# Altium project FMU_F7H7.PrjPcb
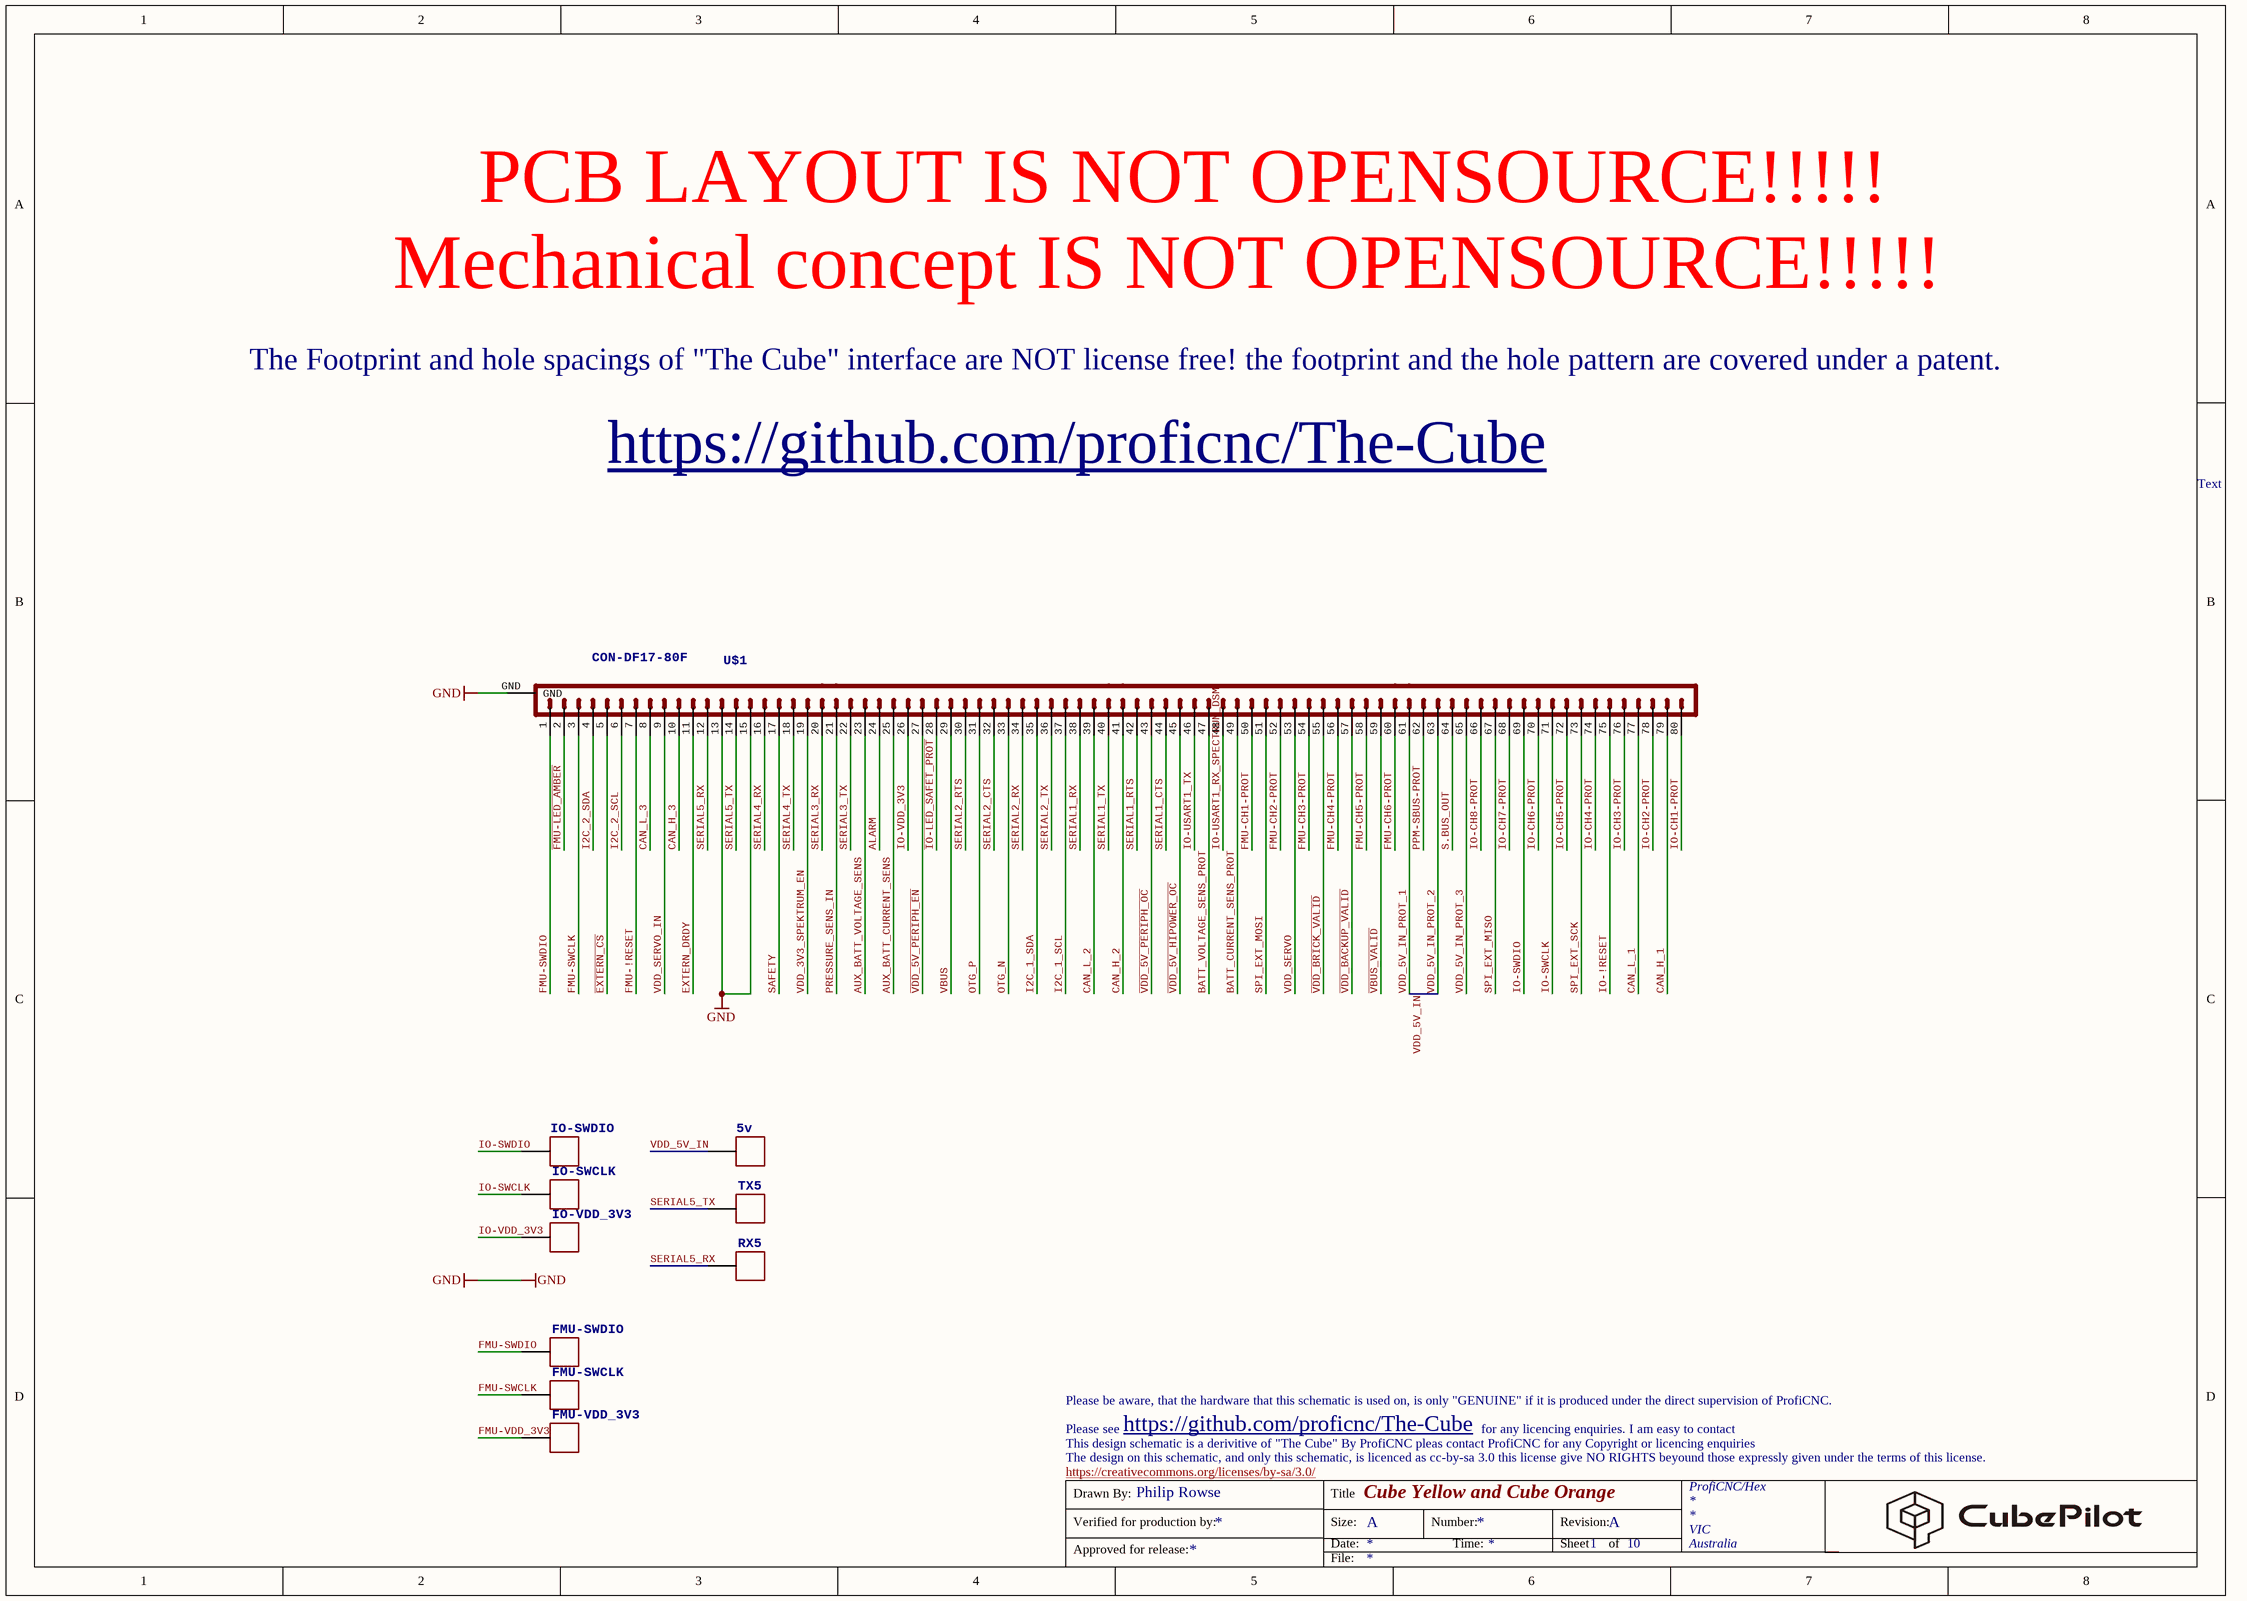
[diagram p0: 80PIN_FMU_REV_2A.SchDoc]
10 sheets, 142 parts. Net scope: global (net labels, ports and power ports of the same name join across sheets).
Board file: CubeOrange.PcbDoc
Sheets:
  80PIN_FMU_REV_2A.SchDoc
  FMU_FMU_REV_2A.SchDoc
  FMU_Power_FMU_REV_2A.SchDoc
  IO_FMU_REV_2A.SchDoc
  IO_PWR_FMU_REV_2A.SchDoc
  LEDs_FMU_REV_2A.SchDoc
  PWM_PPM_FMU_REV_2A.SchDoc
  SD_USB_FMU_REV_2A.SchDoc
  SENSORS_FMU_REV_2A.SchDoc
  SERIAL_FMU_REV_2A.SchDoc

## Sheet 80PIN_FMU_REV_2A.SchDoc: Cube Yellow and Cube Orange
size A3; Date: 18/08/2014 1:53:28 PM; Author: PR; DrawnBy: Philip Rowse; Engineer: Philip Rowse; Organization: ProfiCNC/Hex; Address3: VIC; Address4: Australia; Revision: A; SheetNumber: 1; SheetTotal: 10

### Parts
5v  PAD.04  [PAD.04X.04]  (value not drawn)
FMU-SWCLK  PAD.04  [PAD.04X.04]  (value not drawn)
FMU-SWDIO  PAD.04  [PAD.04X.04]  (value not drawn)
FMU-VDD_3V3  PAD.04  [PAD.04X.04]  (value not drawn)
IO-SWCLK  PAD.04  [PAD.04X.04]  (value not drawn)
IO-SWDIO  PAD.04  [PAD.04X.04]  (value not drawn)
IO-VDD_3V3  PAD.04  [PAD.04X.04]  (value not drawn)
RX5  PAD.04  [PAD.04X.04]  (value not drawn)
TX5  PAD.04  [PAD.04X.04]  (value not drawn)
U$1  CON-DF17-80F  [CON-DF17-80F]

### Nets
GND: U$1.13 U$1.15 U$1.GND
ALARM: U$1.24
AUX_BATT_CURRENT_SENS: U$1.25
AUX_BATT_VOLTAGE_SENS: U$1.23
BATT_CURRENT_SENS_PROT: U$1.49
BATT_VOLTAGE_SENS_PROT: U$1.47
CAN_H_1: U$1.79
CAN_H_2: U$1.41
CAN_H_3: U$1.10
CAN_L_1: U$1.77
CAN_L_2: U$1.39
CAN_L_3: U$1.8
~{EXTERN_CS}: U$1.5
EXTERN_DRDY: U$1.11
~{FMU-LED_AMBER}: U$1.2
FMU-!RESET: U$1.7
FMU-CH1-PROT: U$1.50
FMU-CH2-PROT: U$1.52
FMU-CH3-PROT: U$1.54
FMU-CH4-PROT: U$1.56
FMU-CH5-PROT: U$1.58
FMU-CH6-PROT: U$1.60
FMU-SWCLK: FMU-SWCLK.P$1 U$1.3
FMU-SWDIO: FMU-SWDIO.P$1 U$1.1
FMU-VDD_3V3: FMU-VDD_3V3.P$1
I2C_1_SCL: U$1.37
I2C_1_SDA: U$1.35
I2C_2_SCL: U$1.6
I2C_2_SDA: U$1.4
~{IO-LED_SAFET_PROT}: U$1.28
IO-!RESET: U$1.75
IO-CH1-PROT: U$1.80
IO-CH2-PROT: U$1.78
IO-CH3-PROT: U$1.76
IO-CH4-PROT: U$1.74
IO-CH5-PROT: U$1.72
IO-CH6-PROT: U$1.70
IO-CH7-PROT: U$1.68
IO-CH8-PROT: U$1.66
IO-SWCLK: IO-SWCLK.P$1 U$1.71
IO-SWDIO: IO-SWDIO.P$1 U$1.69
IO-USART1_RX_SPECTRUM_DSM: U$1.48
IO-USART1_TX: U$1.46
IO-VDD_3V3: IO-VDD_3V3.P$1 U$1.26
OTG_N: U$1.33
OTG_P: U$1.31
PPM-SBUS-PROT: U$1.62
PRESSURE_SENS_IN: U$1.21
S.BUS_OUT: U$1.64
SAFETY: U$1.17
SERIAL1_CTS: U$1.44
SERIAL1_RTS: U$1.42
SERIAL1_RX: U$1.38
SERIAL1_TX: U$1.40
SERIAL2_CTS: U$1.32
SERIAL2_RTS: U$1.30
SERIAL2_RX: U$1.34
SERIAL2_TX: U$1.36
SERIAL3_RX: U$1.20
SERIAL3_TX: U$1.22
SERIAL4_RX: U$1.16
SERIAL4_TX: U$1.18
SERIAL5_RX: RX5.P$1 U$1.12
SERIAL5_TX: TX5.P$1 U$1.14
SPI_EXT_MISO: U$1.67
SPI_EXT_MOSI: U$1.51
SPI_EXT_SCK: U$1.73
~{VBUS_VALID}: U$1.59
~{VDD_5V_HIPOWER_OC}: U$1.45
~{VDD_5V_PERIPH_EN}: U$1.27
~{VDD_5V_PERIPH_OC}: U$1.43
~{VDD_BACKUP_VALID}: U$1.57
~{VDD_BRICK_VALID}: U$1.55
VBUS: U$1.29
VDD_3V3_SPEKTRUM_EN: U$1.19
VDD_5V_IN: 5v.P$1 U$1.61 U$1.63  [also labelled VDD_5V_IN_PROT_1, VDD_5V_IN_PROT_2]
VDD_5V_IN_PROT_3: U$1.65
VDD_SERVO: U$1.53
VDD_SERVO_IN: U$1.9

### Notes on the sheet
- PCB LAYOUT IS NOT OPENSOURCE!!!!!
- Mechanical concept IS NOT OPENSOURCE!!!!!
- The Footprint and hole spacings of "The Cube" interface are NOT license free! the footprint and the hole pattern are covered under a patent.
- https://github.com/proficnc/The-Cube
- Text
- Please be aware, that the hardware that this schematic is used on, is only "GENUINE" if it is produced under the direct supervision of ProfiCNC.
- The design on this schematic, and only this schematic, is licenced as cc-by-sa 3.0 this license give NO RIGHTS beyound those expressly given under the terms of this license.
- This design schematic is a derivitive of "The Cube" By ProfiCNC pleas contact ProfiCNC for any Copyright or licencing enquiries
- https://creativecommons.org/licenses/by-sa/3.0/
- Please see
- for any licencing enquiries. I am easy to contact
- Drawn By:
- Verified for production by:
- Approved for release:
- Title
- Size:
- Date:
- A
- Number:
- Time:
- Revision:
- Sheet
- of
- File:

### Library data of the parts
U$1 = CON-DF17-80F: CONN RECEPT 80POS .5MM SMD W/FIT

## Sheet FMU_FMU_REV_2A.SchDoc: Cube Yellow and Cube Orange
size A3; Date: 18/08/2014 1:53:18 PM; Author: PR; DrawnBy: Philip Rowse; Engineer: Philip Rowse; Organization: ProfiCNC/Hex; Address3: VIC; Address4: Australia; Revision: A; SheetNumber: 2; SheetTotal: 10
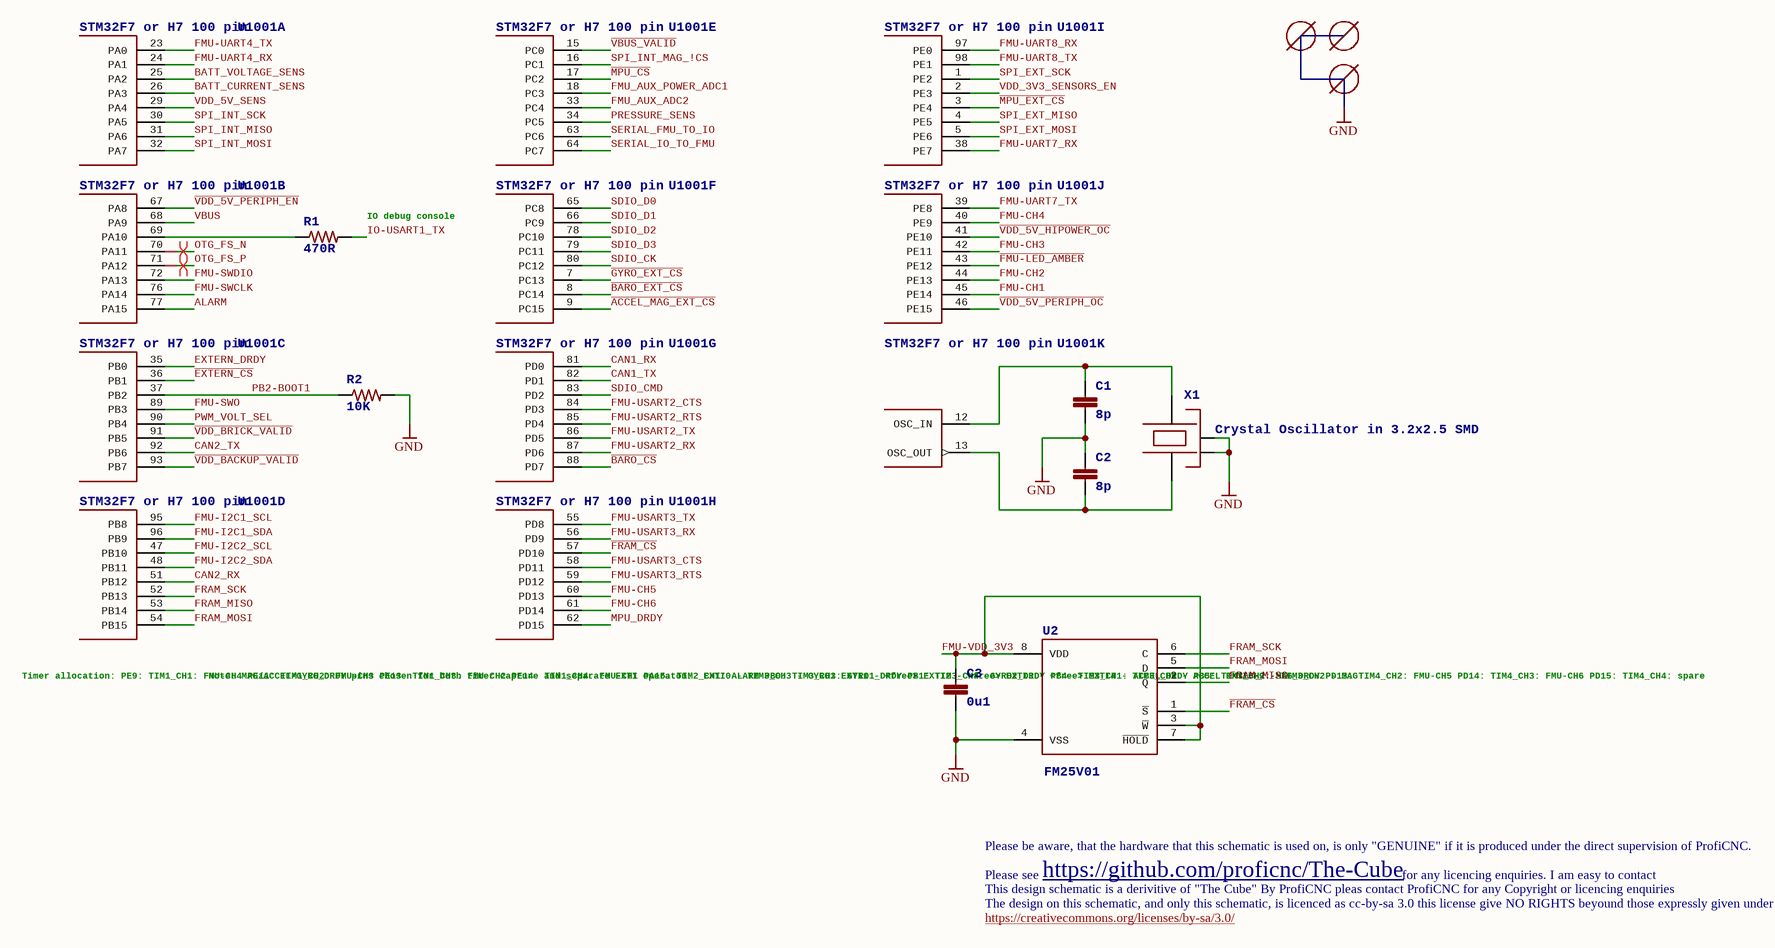
[diagram p1: FMU_FMU_REV_2A.SchDoc]

### Parts
C1  8p  [0402-CAP]
C2  8p  [0402-CAP]
C3  0u1  [0402-CAP]
M1  MOUNT-HOLE1.8MM  [MOUNT-HOLE1.8]  (value not drawn)
M2  MOUNT-HOLE1.8MM  [MOUNT-HOLE1.8]  (value not drawn)
M3  MOUNT-HOLE1.8MM  [MOUNT-HOLE1.8]  (value not drawn)
R1  470R  [0402-RES]
R2  10K  [0402-RES]
U2  FM25V01  [SO08]
U1001  STM32F7 or H7 100 pin  [TQFP100]  (parts A,B,C,D,E,F,G,H,I,J,K of 14)
X1  Crystal Oscillator in 3.2x2.5 SMD  [OSCILLATOR-3.2X2.5]

### Nets
GND: C1.P$2 C2.P$1 C3.P$2 R2.P$2 U2.4(VSS) X1.2(NC_2) X1.4(NC_4)
~{ACCEL_MAG_EXT_CS}: U1001.9(PC15)
ALARM: U1001.77(PA15)
~{BARO_CS}: U1001.88(PD7)
~{BARO_EXT_CS}: U1001.8(PC14)
BATT_CURRENT_SENS: U1001.26(PA3)
BATT_VOLTAGE_SENS: U1001.25(PA2)
CAN1_RX: U1001.81(PD0)
CAN1_TX: U1001.82(PD1)
CAN2_RX: U1001.51(PB12)
CAN2_TX: U1001.92(PB6)
~{EXTERN_CS}: U1001.36(PB1)
EXTERN_DRDY: U1001.35(PB0)
~{FMU-LED_AMBER}: U1001.43(PE12)
~{FRAM_CS}: U2.1(~{S}) U1001.57(PD10)
FMU-CH1: U1001.45(PE14)
FMU-CH2: U1001.44(PE13)
FMU-CH3: U1001.42(PE11)
FMU-CH4: U1001.40(PE9)
FMU-CH5: U1001.60(PD13)
FMU-CH6: U1001.61(PD14)
FMU-I2C1_SCL: U1001.95(PB8)
FMU-I2C1_SDA: U1001.96(PB9)
FMU-I2C2_SCL: U1001.47(PB10)
FMU-I2C2_SDA: U1001.48(PB11)
FMU-SWCLK: U1001.76(PA14)
FMU-SWDIO: U1001.72(PA13)
FMU-SWO: U1001.89(PB3)
FMU-UART4_RX: U1001.24(PA1)
FMU-UART4_TX: U1001.23(PA0)
FMU-UART7_RX: U1001.38(PE7)
FMU-UART7_TX: U1001.39(PE8)
FMU-UART8_RX: U1001.97(PE0)
FMU-UART8_TX: U1001.98(PE1)
FMU-USART2_CTS: U1001.84(PD3)
FMU-USART2_RTS: U1001.85(PD4)
FMU-USART2_RX: U1001.87(PD6)
FMU-USART2_TX: U1001.86(PD5)
FMU-USART3_CTS: U1001.58(PD11)
FMU-USART3_RTS: U1001.59(PD12)
FMU-USART3_RX: U1001.56(PD9)
FMU-USART3_TX: U1001.55(PD8)
FMU-VDD_3V3: C3.P$1 U2.3(~{W}) U2.7(~{HOLD}) U2.8(VDD)
FMU_AUX_ADC2: U1001.33(PC4)
FMU_AUX_POWER_ADC1: U1001.18(PC3)
FRAM_MISO: U2.2(Q) U1001.53(PB14)
FRAM_MOSI: U2.5(D) U1001.54(PB15)
FRAM_SCK: U2.6(C) U1001.52(PB13)
~{GYRO_EXT_CS}: U1001.7(PC13)
IO-USART1_TX: R1.P$2
~{MPU_CS}: U1001.17(PC2)
~{MPU_EXT_CS}: U1001.3(PE4)
MPU_DRDY: U1001.62(PD15)
OTG_FS_N: U1001.70(PA11)
OTG_FS_P: U1001.71(PA12)
PB2-BOOT1: R2.P$1 U1001.37(PB2)
PRESSURE_SENS: U1001.34(PC5)
PWM_VOLT_SEL: U1001.90(PB4)
SDIO_CK: U1001.80(PC12)
SDIO_CMD: U1001.83(PD2)
SDIO_D0: U1001.65(PC8)
SDIO_D1: U1001.66(PC9)
SDIO_D2: U1001.78(PC10)
SDIO_D3: U1001.79(PC11)
SERIAL_FMU_TO_IO: U1001.63(PC6)
SERIAL_IO_TO_FMU: U1001.64(PC7)
SPI_EXT_MISO: U1001.4(PE5)
SPI_EXT_MOSI: U1001.5(PE6)
SPI_EXT_SCK: U1001.1(PE2)
SPI_INT_MAG_!CS: U1001.16(PC1)
SPI_INT_MISO: U1001.31(PA6)
SPI_INT_MOSI: U1001.32(PA7)
SPI_INT_SCK: U1001.30(PA5)
~{VBUS_VALID}: U1001.15(PC0)
~{VDD_5V_HIPOWER_OC}: U1001.41(PE10)
~{VDD_5V_PERIPH_EN}: U1001.67(PA8)
~{VDD_5V_PERIPH_OC}: U1001.46(PE15)
~{VDD_BACKUP_VALID}: U1001.93(PB7)
~{VDD_BRICK_VALID}: U1001.91(PB5)
VBUS: U1001.68(PA9)
VDD_3V3_SENSORS_EN: U1001.2(PE3)
VDD_5V_SENS: U1001.29(PA4)
NetC1_P$1: C1.P$1 U1001.12(OSC_IN) X1.3
NetC2_P$2: C2.P$2 U1001.13(OSC_OUT) X1.1
NetR1_P$1: R1.P$1 U1001.69(PA10)

### Layout directives
differential pair: OTG_FS_N, OTG_FS_P

### Notes on the sheet
- (near R1) IO debug console
- Timer allocation:
  PE9: TIM1_CH1: FMU-CH4
  PE11: TIM1_CH2: FMU-CH3
  PE13: TIM1_CH3: FMU-CH2
  PE14: TIM1_CH4: FMU-CH1
  PA15: TIM2_CH1: ALARM
  PB0: TIM3_CH3: GYRO1_DRDY
  PB1: TIM3_CH4: GYRO2_DRDY
  PB4: TIM3_CH1: ACCEL_DRDY
  PB5: TIM3_CH2: MAG_DRDY
  PD13: TIM4_CH2: FMU-CH5
  PD14: TIM4_CH3: FMU-CH6
  PD15: TIM4_CH4: spare
- Note: MAG/ACCEL/GYRO_DRDY pins chosen
  for both timer capture and separate
  EXTI operaton.
  EXTI0 - TIM3_CH3 - GYRO1
  EXTI1 - <free>
  EXTI2 - <free>
  EXTI3 - <free>
  EXTI4 - TIM3_CH1 - ACCEL
  EXTI5-9 - TIM3_CH2 - MAG
- Please be aware, that the hardware that this schematic is used on, is only "GENUINE" if it is produced under the direct supervision of ProfiCNC.
- The design on this schematic, and only this schematic, is licenced as cc-by-sa 3.0 this license give NO RIGHTS beyound those expressly given under the terms of this license.
- This design schematic is a derivitive of "The Cube" By ProfiCNC pleas contact ProfiCNC for any Copyright or licencing enquiries
- https://creativecommons.org/licenses/by-sa/3.0/
- Please see
- https://github.com/proficnc/The-Cube
- for any licencing enquiries. I am easy to contact
- Drawn By:
- Verified for production by:
- Approved for release:
- Title
- Size:
- Date:
- A
- Number:
- Time:
- Revision:
- Sheet
- of
- File:

### Library data of the parts
C1 C2 = CAP0402: CAP CER 8PF 50V C0G 0402; Value: 8p
C3 = CAP0402: CAP CER 0.1UF 16V Y5V 0402; Value: 0u1
R1 = RESISTOR0402-RES: RES 470 OHM 1/16W 1% 0402 SMD; Value: 470R
R2 = RESISTOR0402-RES: RES 10K OHM 1/16W 1% 0402 SMD; Value: 10K
U2 = FM25V01: IC FRAM 128KBIT 40MHZ 8SOIC; Value: 128k
U1001 = STM32F4X7VX: REV 3 Silicon or later IC MCU ARM 2MB FLASH 100LQFP
X1 = OSCILLATOR-3.2X2.5: CRYSTAL 24MHZ 8PF SMD; Value: 24MHz

## Sheet FMU_Power_FMU_REV_2A.SchDoc: Cube Yellow and Cube Orange
size A3; Date: 18/08/2014 1:53:18 PM; Author: PR; DrawnBy: Philip Rowse; Engineer: Philip Rowse; Organization: ProfiCNC/Hex; Address3: VIC; Address4: Australia; Revision: A; SheetNumber: 3; SheetTotal: 10
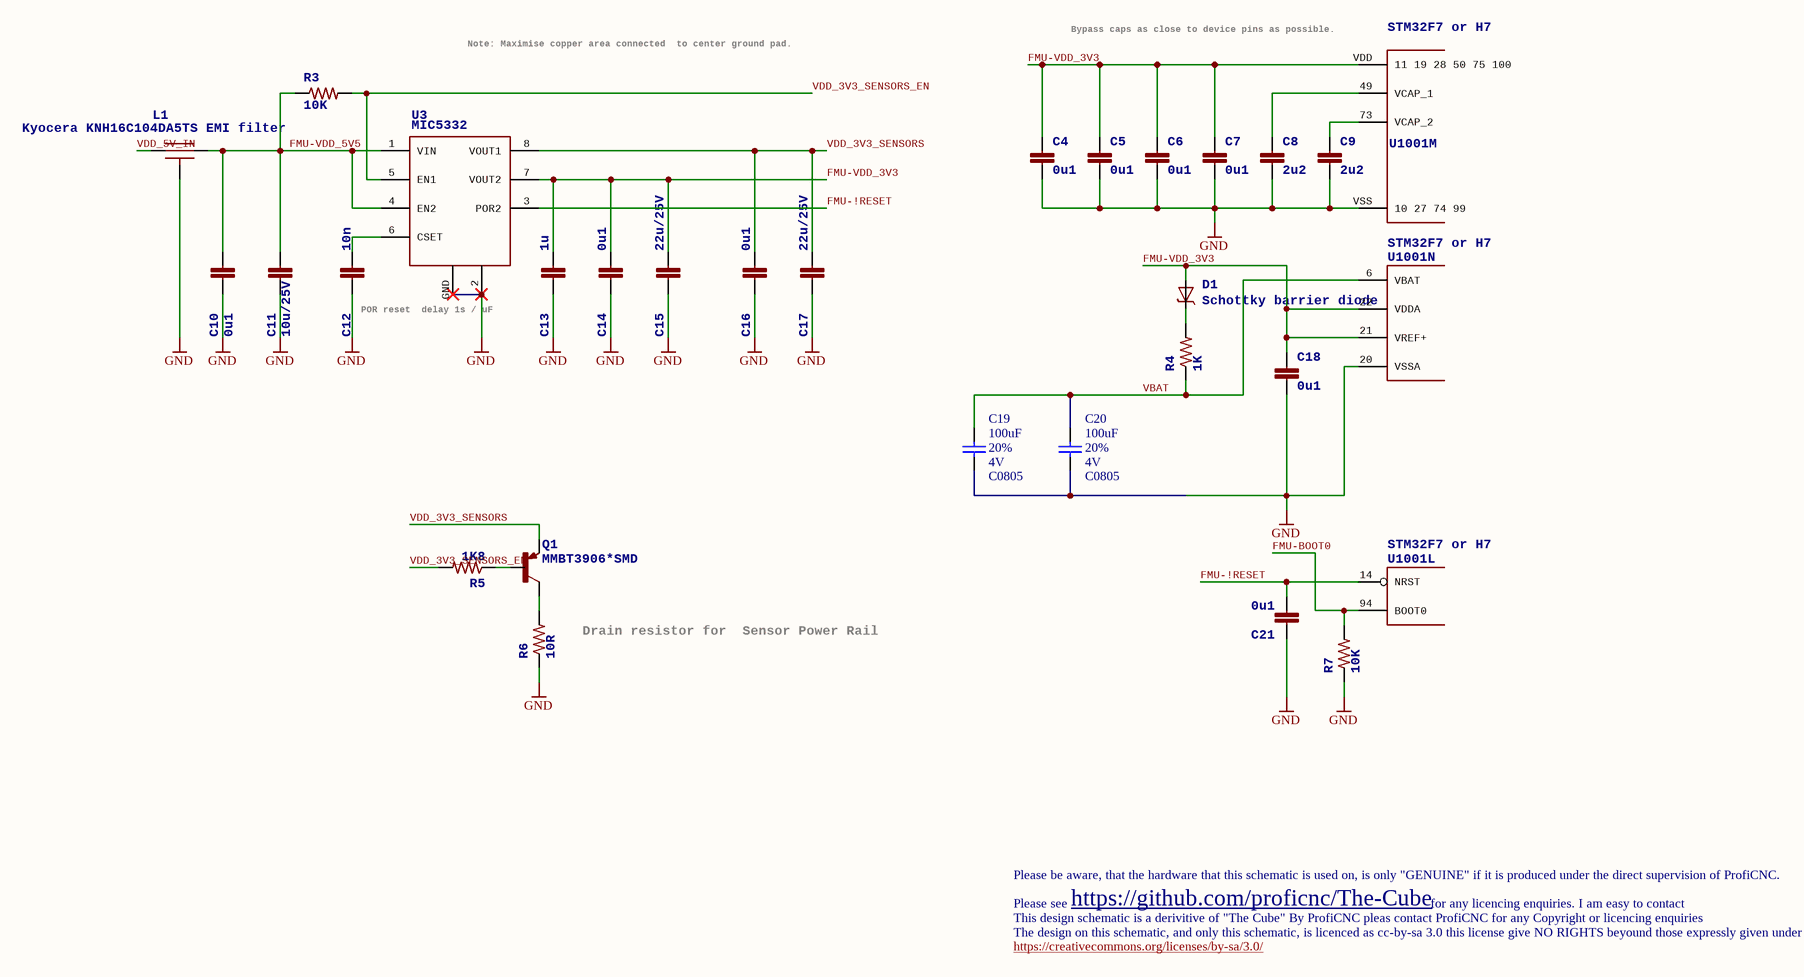
[diagram p2: FMU_Power_FMU_REV_2A.SchDoc]

### Parts
C4  0u1  [0402-CAP]
C5  0u1  [0402-CAP]
C6  0u1  [0402-CAP]
C7  0u1  [0402-CAP]
C8  2u2  [0603-CAP]
C9  2u2  [0603-CAP]
C10  0u1  [0402-CAP]
C11  10u/25V  [0805-CAP]
C12  10n  [0402-CAP]
C13  1u  [0603-CAP]
C14  0u1  [0402-CAP]
C15  22u/25V  [0805-CAP]
C16  0u1  [0402-CAP]
C17  22u/25V  [0805-CAP]
C18  0u1  [0402-CAP]
C19  value 100uF  Tolerance: 20%  Voltage: 4V  [C0805]  (hidden comment: GRM21BR60G107ME15L)
C20  value 100uF  Tolerance: 20%  Voltage: 4V  [C0805]  (hidden comment: GRM21BR60G107ME15L)
C21  0u1  [0402-CAP]
D1  Schottky barrier diode  [SOD323]
L1  Kyocera KNH16C104DA5TS EMI filter  [KYOCERA-KNH16-DA]
Q1  MMBT3906*SMD  [SOT23-BEC]
R3  10K  [0402-RES]
R4  1K  [0402-RES]
R5  1K8  [0402-RES]
R6  10R  [0603-RES]
R7  10K  [0402-RES]
U3  MIC5332  [MLF-8-EPAD]
U1001  STM32F7 or H7  [TQFP100]  (parts L,M,N of 14)

### Nets
GND: C4.P$2 C5.P$2 C6.P$2 C7.P$2 C8.P$2 C9.P$2 C10.P$2 C11.P$2 C12.P$1 C13.P$2 C14.P$2 C15.P$2 C16.P$2 C17.P$2 C18.P$2 C19.1 C20.1 C21.P$1 L1.GND R6.1 R7.P$1 U3.2(GND) U3.GND U1001.20(VSSA) U1001.VSS(10_27_74_99)
FMU-!RESET: C21.P$2 U3.3(POR2) U1001.14(NRST)
FMU-BOOT0: R7.P$2 U1001.94(BOOT0)
FMU-VDD_3V3: C4.P$1 C5.P$1 C6.P$1 C7.P$1 C13.P$1 C14.P$1 C15.P$1 C18.P$1 D1.A U3.7(VOUT2) U1001.21(VREF+) U1001.22(VDDA) U1001.VDD(11_19_28_50_75_100)
FMU-VDD_5V5: C10.P$1 C11.P$1 L1.P$2 R3.P$1 U3.1(VIN) U3.4(EN2)
VBAT: C19.2 C20.2 R4.P$1 U1001.6(VBAT)
VDD_3V3_SENSORS: C16.P$1 C17.P$1 Q1.E U3.8(VOUT1)
VDD_3V3_SENSORS_EN: R3.P$2 R5.P$2 U3.5(EN1)
VDD_5V_IN: L1.P$1
NetC8_P$1: C8.P$1 U1001.49(VCAP_1)
NetC9_P$1: C9.P$1 U1001.73(VCAP_2)
NetC12_P$2: C12.P$2 U3.6(CSET)
NetD1_C: D1.C R4.P$2
NetQ1_B: Q1.B R5.P$1
NetQ1_C: Q1.C R6.2

### Notes on the sheet
- Note: Maximise copper area connected
  to center ground pad.
- Bypass caps as close to device pins as possible.
- POR reset
  delay 1s / uF
- Drain resistor for
  Sensor Power Rail
- Please be aware, that the hardware that this schematic is used on, is only "GENUINE" if it is produced under the direct supervision of ProfiCNC.
- The design on this schematic, and only this schematic, is licenced as cc-by-sa 3.0 this license give NO RIGHTS beyound those expressly given under the terms of this license.
- This design schematic is a derivitive of "The Cube" By ProfiCNC pleas contact ProfiCNC for any Copyright or licencing enquiries
- https://creativecommons.org/licenses/by-sa/3.0/
- Please see
- https://github.com/proficnc/The-Cube
- for any licencing enquiries. I am easy to contact
- Drawn By:
- Verified for production by:
- Approved for release:
- Title
- Size:
- Date:
- A
- Number:
- Time:
- Revision:
- Sheet
- of
- File:

### Library data of the parts
C4-C7 C10 C14 C16 C18 C21 = CAP0402: CAP CER 0.1UF 16V Y5V 0402; Value: 0u1
C8 C9 = CAP0603: CAP CER 2.2UF 16V 10% X6S 0603; Value: 2u2
C11 = CAP0805: CAP CER 10UF 25V 10% X5R 0805; Value: 10u/25
C12 = CAP0402: CAP CER 10000PF 16V 10% X7R 0402; Value: 10n
C13 = CAP0603: CAP CER 1UF 16V Y5V 0603; Value: 1u
C15 C17 = CAP0805: CAP CER 22UF 25V 20% X5R 0805; Value: 22u/25V
C19 C20 = Capacitor
D1 = DIODE-SCHOTTKY_SOD323: DIODE SCHOTTKY 30V 0.03A SOD323; Value: 30V
L1 = KNH16C104DA5TS: FILTER CAP 0.1UF 2A 25V 0603; Value: 0u1
Q1 = MMBT3906*SMD: TRANSISTOR SWITCHING PNP SOT-23
R3 R7 = RESISTOR0402-RES: RES 10K OHM 1/16W 1% 0402 SMD; Value: 10K
R4 = RESISTOR0402-RES: RES 1K OHM 1/16W 1% 0402; Value: 1K
R5 = RESISTOR0402-RES: RES 1.8K OHM 1/16W 1% 0402; Value: 1K8
R6 = RESISTOR0603-RES: RES 10 OHM 1/10W 5% 0603; Value: 10R
U3 = MIC5332: IC REG LDO 3.3V 0.3A 8TMLF; Value: 3.3V
U1001 = STM32F4X7VX: as U1001 on sheet FMU_FMU_REV_2A

## Sheet IO_FMU_REV_2A.SchDoc: Cube Yellow and Cube Orange
size A3; Date: 18/08/2014 1:53:23 PM; Author: PR; DrawnBy: Philip Rowse; Engineer: Philip Rowse; Organization: ProfiCNC/Hex; Address3: VIC; Address4: Australia; Revision: A; SheetNumber: 4; SheetTotal: 10
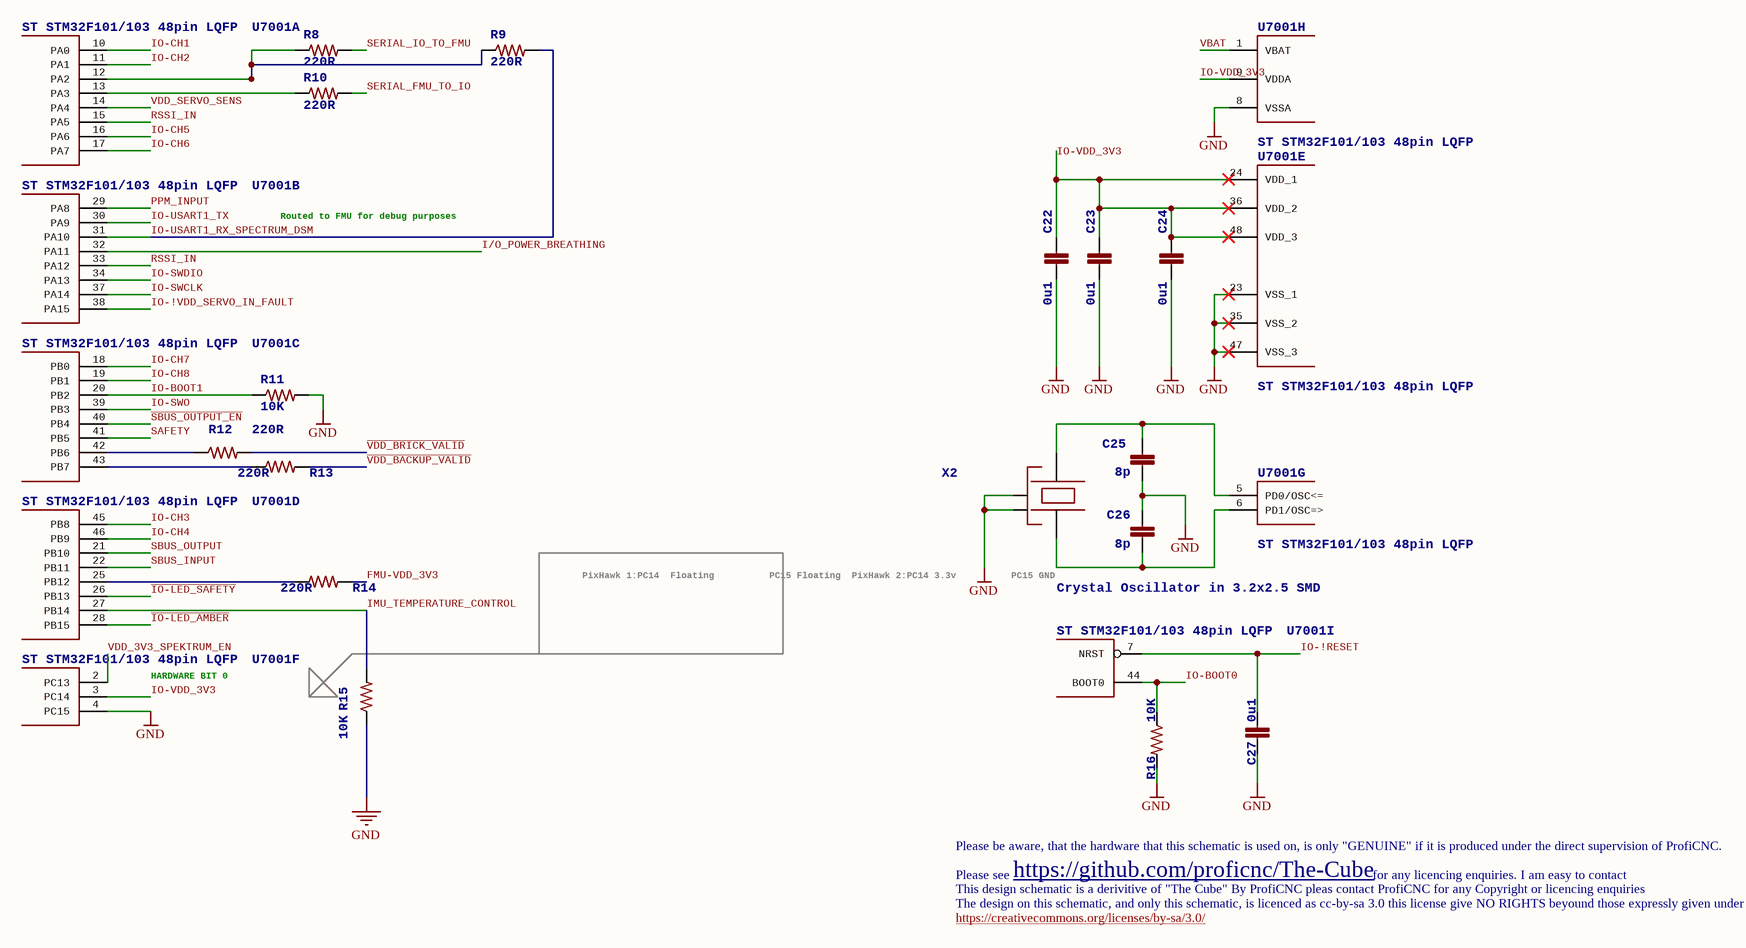
[diagram p3: IO_FMU_REV_2A.SchDoc]

### Parts
C22  0u1  [0402-CAP]
C23  0u1  [0402-CAP]
C24  0u1  [0402-CAP]
C25  8p  [0402-CAP]
C26  8p  [0402-CAP]
C27  0u1  [0402-CAP]
R8  220R  [0402-RES]
R9  220R  [0402-RES]
R10  220R  [0402-RES]
R11  10K  [0402-RES]
R12  220R  [0402-RES]
R13  220R  [0402-RES]
R14  220R  [0402-RES]
R15  10K  [0402-RES]
R16  10K  [0402-RES]
U7001  ST STM32F101/103 48pin LQFP  [TQFP48]  (parts A,B,C,D,E,F,G,H,I of 9)
X2  Crystal Oscillator in 3.2x2.5 SMD  [OSCILLATOR-3.2X2.5]

### Nets
GND: C22.P$2 C23.P$2 C24.P$2 C25.P$2 C26.P$1 C27.P$1 R11.P$2 R15.P$1 R16.P$2 U7001.4(PC15) U7001.8(VSSA) U7001.23(VSS_1) U7001.35(VSS_2) U7001.47(VSS_3) X2.2(NC_2) X2.4(NC_4)
FMU-VDD_3V3: R14.P$2
I/O_POWER_BREATHING: U7001.32(PA11)
~{IO-LED_AMBER}: U7001.28(PB15)
~{IO-LED_SAFETY}: U7001.26(PB13)
IMU_TEMPERATURE_CONTROL: R15.P$2 U7001.27(PB14)
IO-!RESET: C27.P$2 U7001.7(NRST)
IO-!VDD_SERVO_IN_FAULT: U7001.38(PA15)
IO-BOOT0: R16.P$1 U7001.44(BOOT0)
IO-BOOT1: R11.P$1 U7001.20(PB2)
IO-CH1: U7001.10(PA0)
IO-CH2: U7001.11(PA1)
IO-CH3: U7001.45(PB8)
IO-CH4: U7001.46(PB9)
IO-CH5: U7001.16(PA6)
IO-CH6: U7001.17(PA7)
IO-CH7: U7001.18(PB0)
IO-CH8: U7001.19(PB1)
IO-SWCLK: U7001.37(PA14)
IO-SWDIO: U7001.34(PA13)
IO-SWO: U7001.39(PB3)
IO-USART1_RX_SPECTRUM_DSM: R9.P$2 U7001.31(PA10)
IO-USART1_TX: U7001.30(PA9)
IO-VDD_3V3: C22.P$1 C23.P$1 C24.P$1 U7001.3(PC14) U7001.9(VDDA) U7001.24(VDD_1) U7001.36(VDD_2) U7001.48(VDD_3)
PPM_INPUT: U7001.29(PA8)
RSSI_IN: U7001.15(PA5) U7001.33(PA12)
~{SBUS_OUTPUT_EN}: U7001.40(PB4)
SAFETY: U7001.41(PB5)
SBUS_INPUT: U7001.22(PB11)
SBUS_OUTPUT: U7001.21(PB10)
SERIAL_FMU_TO_IO: R10.P$2
SERIAL_IO_TO_FMU: R8.P$2
~{VDD_BACKUP_VALID}: R13.P$2
~{VDD_BRICK_VALID}: R12.P$2
VBAT: U7001.1(VBAT)
VDD_3V3_SPEKTRUM_EN: U7001.2(PC13)
VDD_SERVO_SENS: U7001.14(PA4)
NetC25_P$1: C25.P$1 U7001.5(PD0/OSC<=) X2.3
NetC26_P$2: C26.P$2 U7001.6(PD1/OSC=>) X2.1
NetR8_P$1: R8.P$1 R9.P$1 U7001.12(PA2)
NetR10_P$1: R10.P$1 U7001.13(PA3)
NetR12_P$1: R12.P$1 U7001.42(PB6)
NetR13_P$1: R13.P$1 U7001.43(PB7)
NetR14_P$1: R14.P$1 U7001.25(PB12)

### Notes on the sheet
- Routed to FMU for debug purposes
- PixHawk 1:PC14  Floating
  PC15 Floating
  PixHawk 2:PC14 3.3v
  PC15 GND
- HARDWARE BIT 0
- Please be aware, that the hardware that this schematic is used on, is only "GENUINE" if it is produced under the direct supervision of ProfiCNC.
- The design on this schematic, and only this schematic, is licenced as cc-by-sa 3.0 this license give NO RIGHTS beyound those expressly given under the terms of this license.
- This design schematic is a derivitive of "The Cube" By ProfiCNC pleas contact ProfiCNC for any Copyright or licencing enquiries
- https://creativecommons.org/licenses/by-sa/3.0/
- Please see
- https://github.com/proficnc/The-Cube
- for any licencing enquiries. I am easy to contact
- Drawn By:
- Verified for production by:
- Approved for release:
- Title
- Size:
- Date:
- A
- Number:
- Time:
- Revision:
- Sheet
- of
- File:

### Library data of the parts
C22-C24 C27 = CAP0402: CAP CER 0.1UF 16V Y5V 0402; Value: 0u1
C25 C26 = CAP0402: CAP CER 8PF 50V C0G 0402; Value: 8p
R8-R10 R12-R14 = RESISTOR0402-RES: RES 220 OHM 1/16W 1% 0402 SMD; Value: 220R
R11 R15 R16 = RESISTOR0402-RES: RES 10K OHM 1/16W 1% 0402 SMD; Value: 10K
U7001 = STM32F10XCXT6: MCU 32BIT ARM 64K FLASH 48LQFP
X2 = OSCILLATOR-3.2X2.5: CRYSTAL 24MHZ 8PF SMD; Value: 24MHz

## Sheet IO_PWR_FMU_REV_2A.SchDoc: Cube Yellow and Cube Orange
size A3; Date: 18/08/2014 1:53:31 PM; Author: PR; DrawnBy: Philip Rowse; Engineer: Philip Rowse; Organization: ProfiCNC/Hex; Address3: VIC; Address4: Australia; Revision: A; SheetNumber: 10; SheetTotal: 10
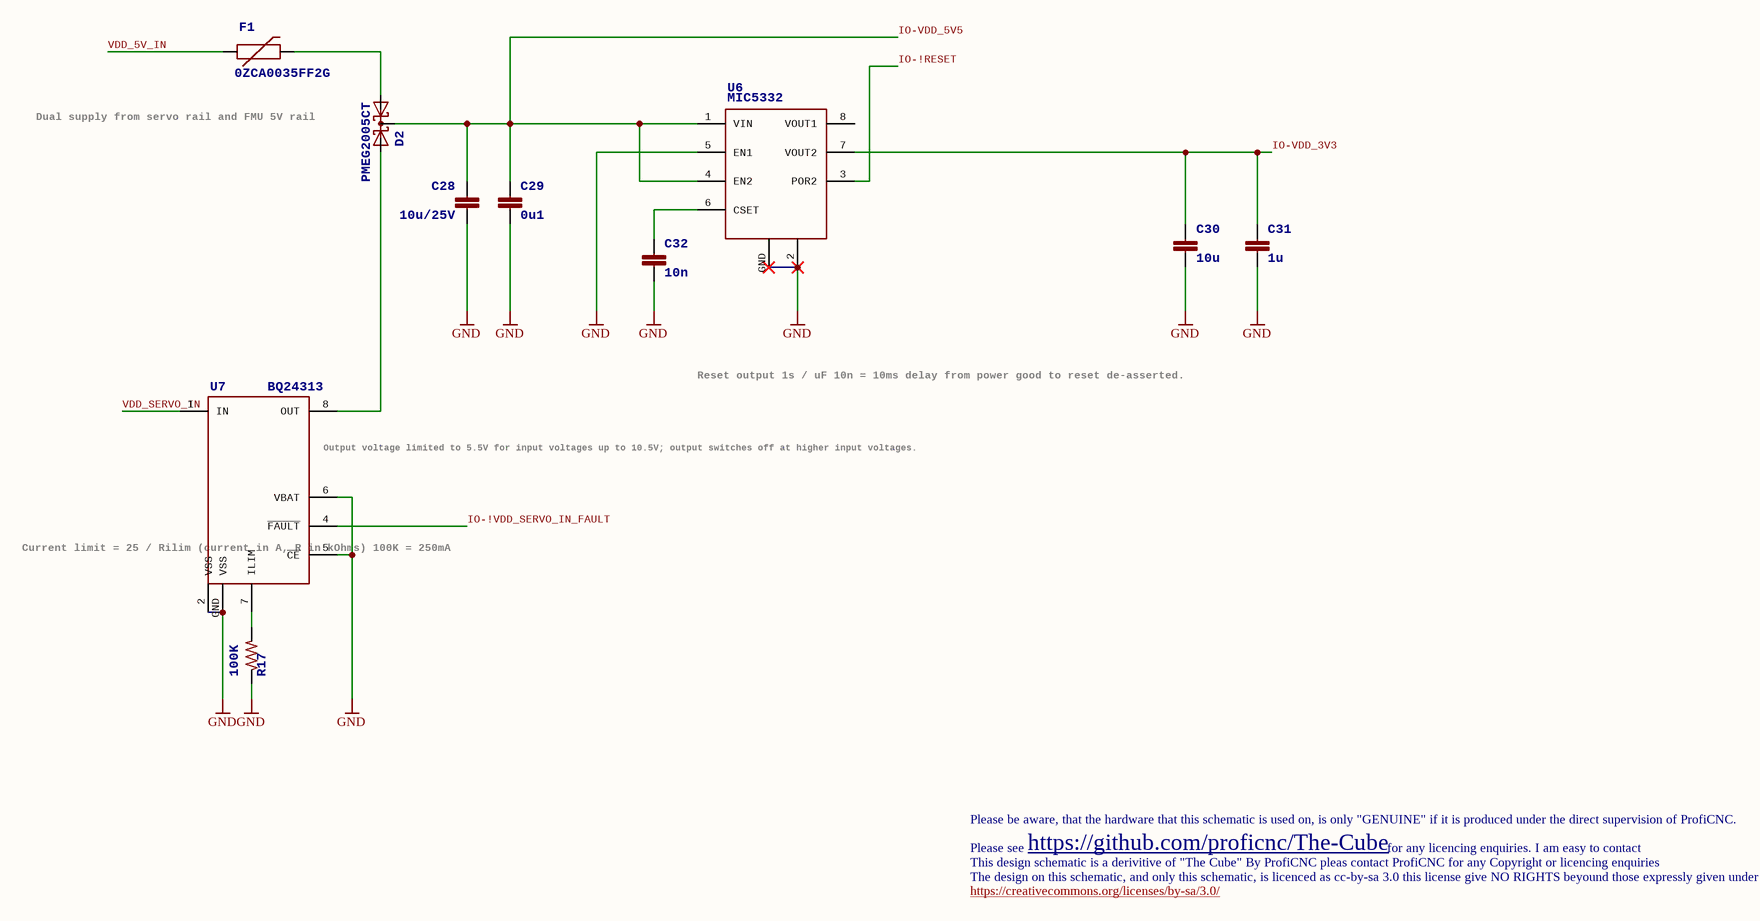
[diagram p4: IO_PWR_FMU_REV_2A.SchDoc]

### Parts
C28  10u/25V  [0805-CAP]
C29  0u1  [0402-CAP]
C30  10u  [0603-CAP]
C31  1u  [0603-CAP]
C32  10n  [0402-CAP]
D2  PMEG2005CT  [SOT23-3]
F1  0ZCA0035FF2G  [PTC-1206]
Logo1  ProfiCNC_LOGO  [ProfiCNC_medium]  (value not drawn)  (no BOM)
R17  100K  [0402-RES]
U6  MIC5332  [MLF-8-EPAD]
U7  BQ24313  [QFN8-DSG]

### Nets
GND: C28.P$2 C29.P$2 C30.P$2 C31.P$2 C32.P$2 R17.P$1 U6.2(GND) U6.5(EN1) U6.GND U7.2(VSS) U7.5(~{CE}) U7.6(VBAT) U7.GND(VSS)
IO-!RESET: U6.3(POR2)
IO-!VDD_SERVO_IN_FAULT: U7.4(~{FAULT})
IO-VDD_3V3: C30.P$1 C31.P$1 U6.7(VOUT2)
IO-VDD_5V5: C28.P$1 C29.P$1 D2.3(CC) U6.1(VIN) U6.4(EN2)
VDD_5V_IN: F1.1
VDD_SERVO_IN: U7.1(IN)
NetC32_P$1: C32.P$1 U6.6(CSET)
NetD2_1: D2.1(A1) F1.2
NetD2_2: D2.2(A2) U7.8(OUT)
NetR17_P$2: R17.P$2 U7.7(ILIM)

Not connected (* = marked no-connect by the designer): U6 8(VOUT1)

### Notes on the sheet
- Dual supply from
  servo rail and FMU 5V rail
- Reset output 1s / uF
  10n = 10ms delay from power good
  to reset de-asserted.
- (near U7) Output voltage limited to 5.5V for
  input voltages up to 10.5V; output
  switches off at higher input voltages.
- (near U7) Current limit = 25 / Rilim
  (current in A, R in kOhms)
  100K = 250mA
- Please be aware, that the hardware that this schematic is used on, is only "GENUINE" if it is produced under the direct supervision of ProfiCNC.
- The design on this schematic, and only this schematic, is licenced as cc-by-sa 3.0 this license give NO RIGHTS beyound those expressly given under the terms of this license.
- This design schematic is a derivitive of "The Cube" By ProfiCNC pleas contact ProfiCNC for any Copyright or licencing enquiries
- https://creativecommons.org/licenses/by-sa/3.0/
- Please see
- https://github.com/proficnc/The-Cube
- for any licencing enquiries. I am easy to contact
- Drawn By:
- Verified for production by:
- Approved for release:
- Title
- Size:
- Date:
- A
- Number:
- Time:
- Revision:
- Sheet
- of
- File:

### Library data of the parts
C28 = CAP0805: as C11 on sheet FMU_Power_FMU_REV_2A
C29 = CAP0402: CAP CER 0.1UF 16V Y5V 0402; Value: 0u1
C30 = CAP0603: CAP CER 10UF 10V 10% X5R 0603; Value: 10u
C31 = CAP0603: CAP CER 1UF 16V Y5V 0603; Value: 1u
C32 = CAP0402: CAP CER 10000PF 16V 10% X7R 0402; Value: 10n
D2 = PMEG2005CT: DIODE SCHOTTKY 20V 500MA TO236AB; Value: 20V
F1 = PTCSMD: PTC RESTTBLE 0.35A 16V CHIP 1206; Value: 0.35A
R17 = RESISTOR0402-RES: RES 100K OHM 1/16W 1% 0402 SMD; Value: 100K
U6 = MIC5332: IC REG LDO 3.3V 0.3A 8TMLF; Value: 3.3V
U7 = BQ24313: IC LI+ CHARGER FRONT END 8-SON

## Sheet LEDs_FMU_REV_2A.SchDoc: Cube Yellow and Cube Orange
size A3; Date: 18/08/2014 1:53:21 PM; Author: PR; DrawnBy: Philip Rowse; Engineer: Philip Rowse; Organization: ProfiCNC/Hex; Address3: VIC; Address4: Australia; Revision: A; SheetNumber: 6; SheetTotal: 10
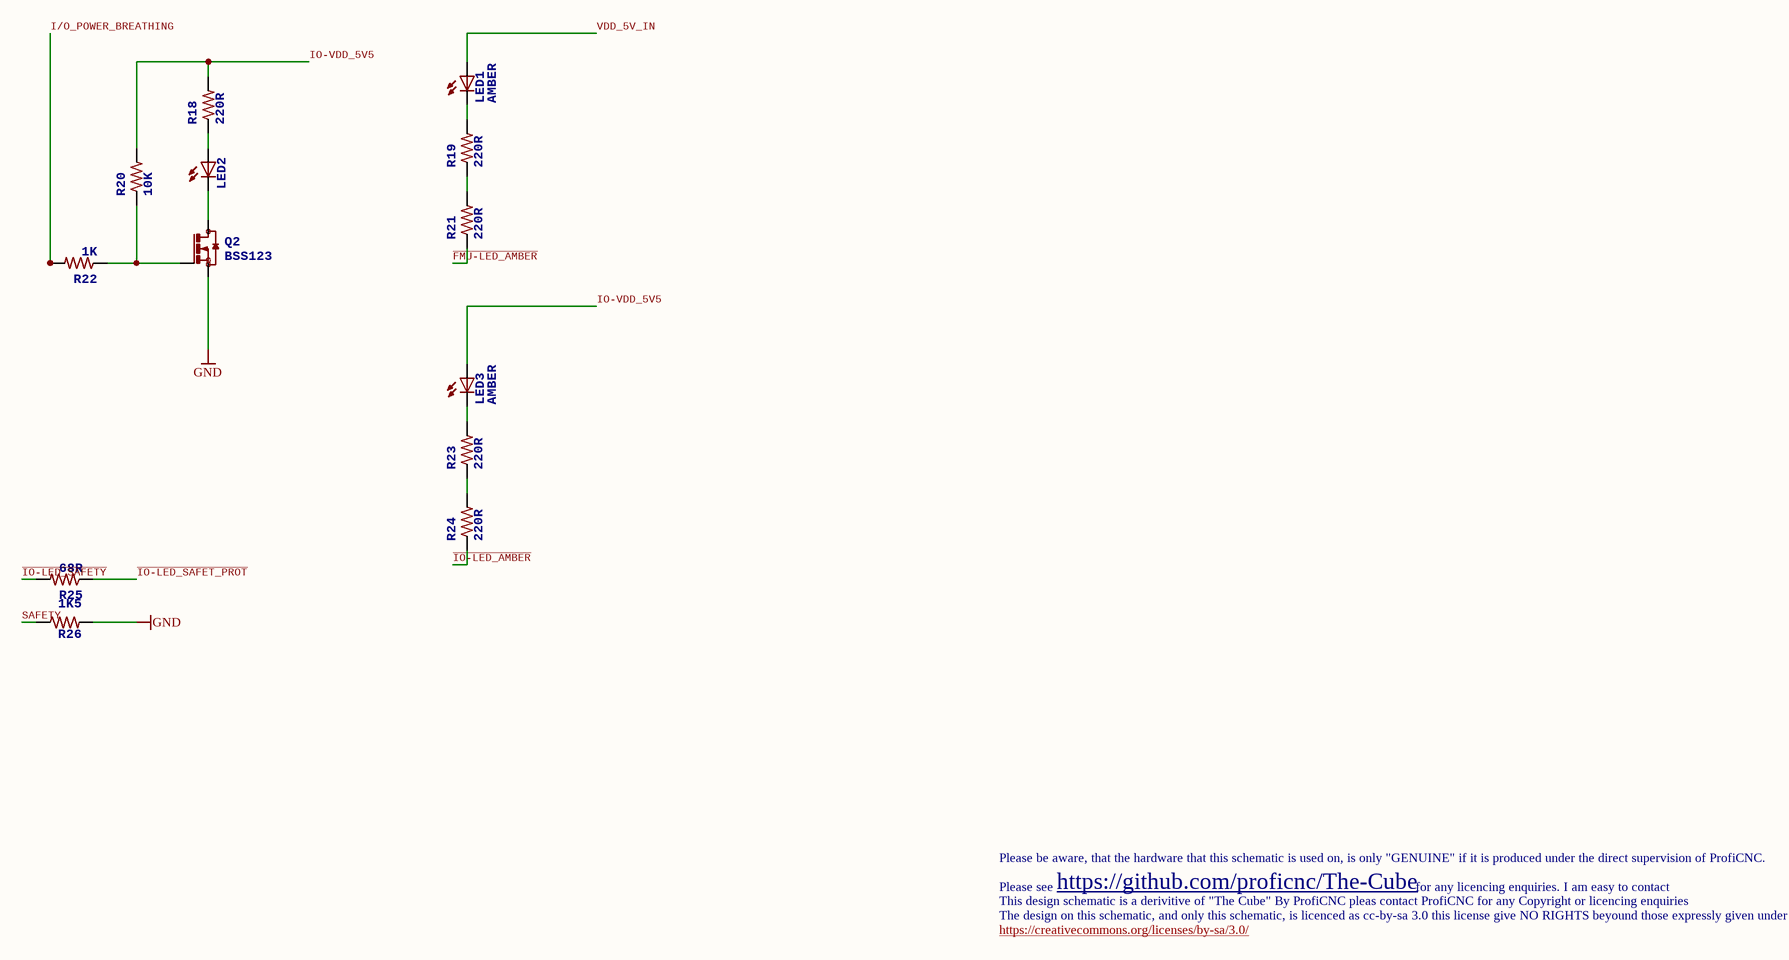
[diagram p5: LEDs_FMU_REV_2A.SchDoc]

### Parts
LED1  AMBER  [0603-LED]
LED2  LED0603_Green  [0603-LED-Blue]  (value not drawn)
LED3  AMBER  [0603-LED]
Q2  BSS123  [SOT23]
R18  220R  [0402-RES]
R19  220R  [0402-RES]
R20  10K  [0402-RES]
R21  220R  [0402-RES]
R22  1K  [0402-RES]
R23  220R  [0402-RES]
R24  220R  [0402-RES]
R25  68R  [0402-RES]
R26  1K5  [0402-RES]

### Nets
GND: Q2.2(S) R26.P$2
~{FMU-LED_AMBER}: R21.P$1
I/O_POWER_BREATHING: R22.P$2
~{IO-LED_AMBER}: R24.P$1
~{IO-LED_SAFET_PROT}: R25.P$1
~{IO-LED_SAFETY}: R25.P$2
IO-VDD_5V5: LED3.A R18.P$2 R20.P$2
SAFETY: R26.P$1
VDD_5V_IN: LED1.A
NetLED1_C: LED1.C R19.P$2
NetLED2_A: LED2.A R18.P$1
NetLED2_C: LED2.C Q2.3(D)
NetLED3_C: LED3.C R23.P$2
NetQ2_1: Q2.1(G) R20.P$1 R22.P$1
NetR19_P$1: R19.P$1 R21.P$2
NetR23_P$1: R23.P$1 R24.P$2

### Notes on the sheet
- Please be aware, that the hardware that this schematic is used on, is only "GENUINE" if it is produced under the direct supervision of ProfiCNC.
- The design on this schematic, and only this schematic, is licenced as cc-by-sa 3.0 this license give NO RIGHTS beyound those expressly given under the terms of this license.
- This design schematic is a derivitive of "The Cube" By ProfiCNC pleas contact ProfiCNC for any Copyright or licencing enquiries
- https://creativecommons.org/licenses/by-sa/3.0/
- Please see
- https://github.com/proficnc/The-Cube
- for any licencing enquiries. I am easy to contact
- Drawn By:
- Verified for production by:
- Approved for release:
- Title
- Size:
- Date:
- A
- Number:
- Time:
- Revision:
- Sheet
- of
- File:

### Library data of the parts
LED1 LED3 = LED0603: LED 1.6X0.8 DOME ORN CLEAR SMD; Value: AMBER
LED2 = LED0603_Blue: LED GREEN ROUND CLEAR SMD; Value: GREEN
Q2 = BSS123: MOSFET N-CH 100V 170MA SOT23-3; Value: 100V
R18 R19 R21 R23 R24 = RESISTOR0402-RES: RES 220 OHM 1/16W 1% 0402 SMD; Value: 220R
R20 = RESISTOR0402-RES: RES 10K OHM 1/16W 1% 0402 SMD; Value: 10K
R22 = RESISTOR0402-RES: RES 1K OHM 1/16W 1% 0402; Value: 1K
R25 = RESISTOR0402-RES: Thick Film Resistors - SMD 0402 68ohms 5% Tol; Value: 68R
R26 = RESISTOR0402-RES: RES 1.5K OHM 1/16W 1% 0402 SMD; Value: 1K5

## Sheet PWM_PPM_FMU_REV_2A.SchDoc: Cube Yellow and Cube Orange
size A3; Date: 18/08/2014 1:53:26 PM; Author: PR; DrawnBy: Philip Rowse; Engineer: Philip Rowse; Organization: ProfiCNC/Hex; Address3: VIC; Address4: Australia; Revision: A; SheetNumber: 7; SheetTotal: 10
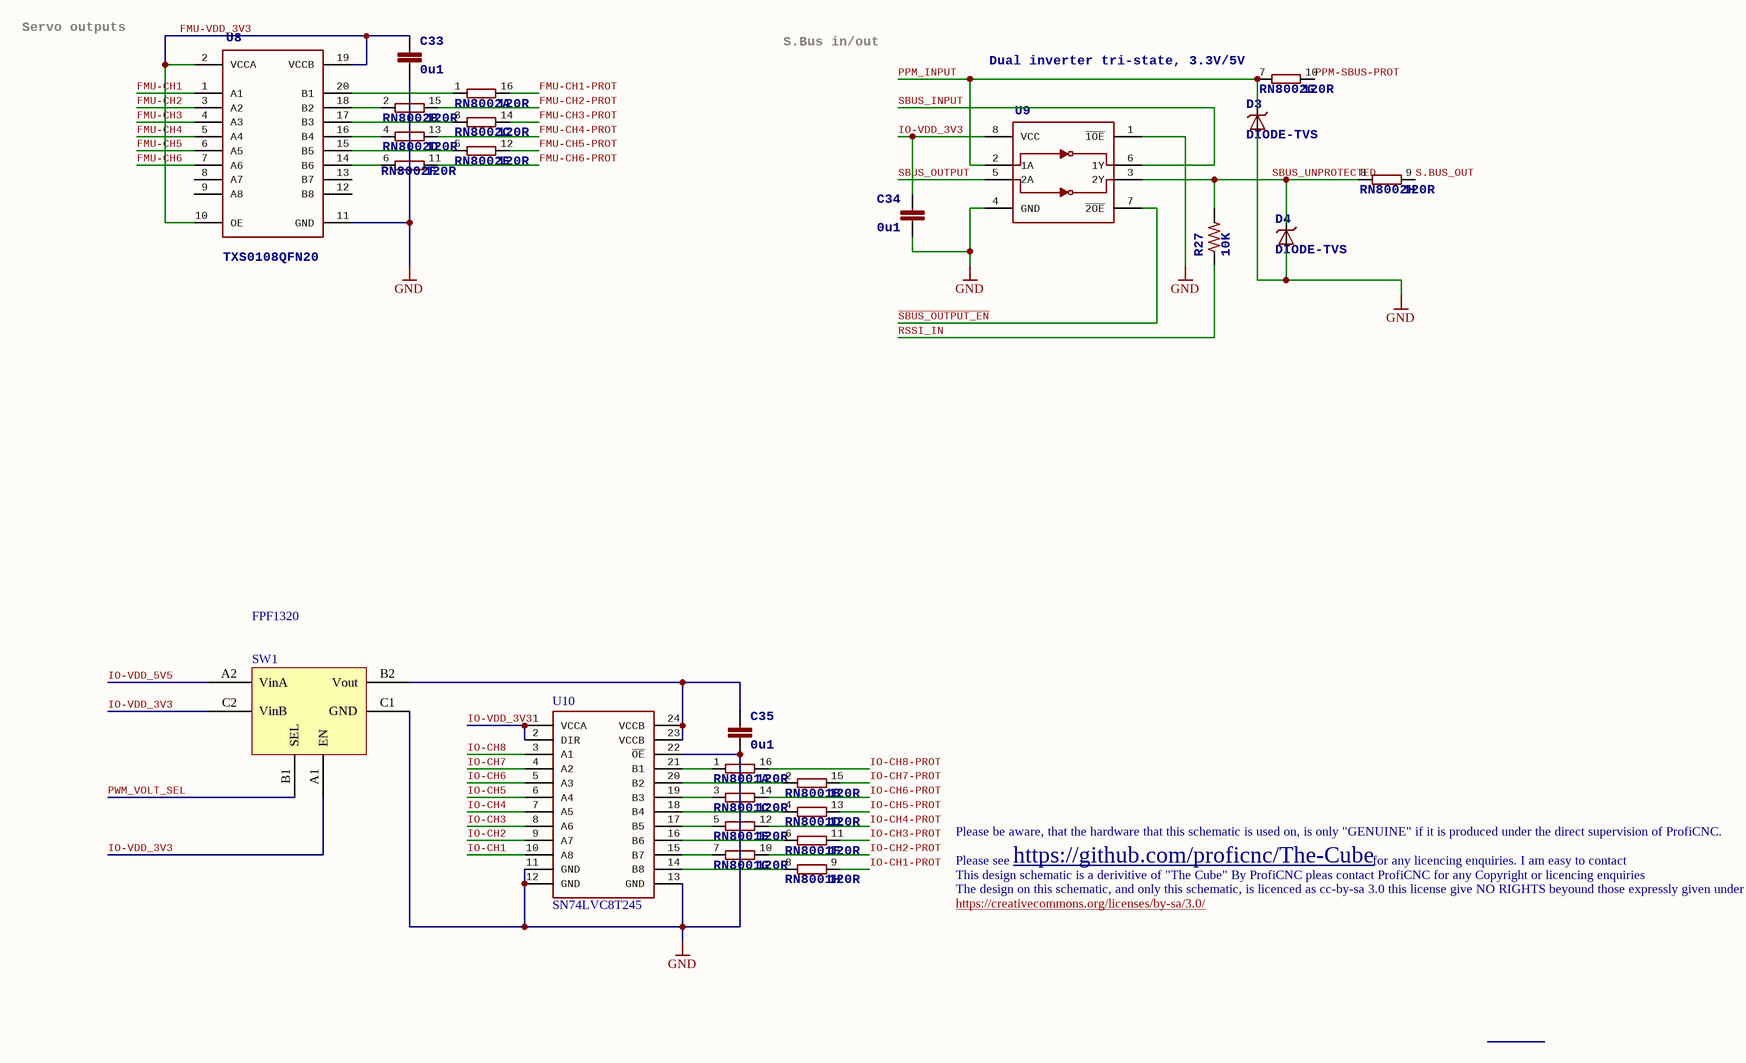
[diagram p6: PWM_PPM_FMU_REV_2A.SchDoc]

### Parts
C33  0u1  [0402-CAP]
C34  0u1  [0402-CAP]
C35  0u1  [0402-CAP]
D3  DIODE-TVS  [0402-TVS]
D4  DIODE-TVS  [0402-TVS]
R27  10K  [0402-RES]
RN8001  120R  [EXB2HV]  (parts A,B,C,D,E,F,G,H of 8)
RN8002  120R  [EXB2HV]  (parts A,B,C,D,E,F,G,H of 8)
SW1  FPF1320  [FPF1320]
U8  TXS0108QFN20  [QFN20-RGY]
U9  Dual inverter tri-state, 3.3V/5V  [TSSOP8_SOT505-2]
U10  SN74LVC8T245  [QFN24-RGY]

### Nets
GND: C33.P$2 C34.P$2 C35.P$2 D3.A D4.A SW1.C1(GND) U8.11(GND) U9.1(~{1OE}) U9.4(GND) U10.11(GND) U10.12(GND) U10.13(GND) U10.22(~{OE})
FMU-CH1: U8.1(A1)
FMU-CH1-PROT: RN8002.16
FMU-CH2: U8.3(A2)
FMU-CH2-PROT: RN8002.15
FMU-CH3: U8.4(A3)
FMU-CH3-PROT: RN8002.14
FMU-CH4: U8.5(A4)
FMU-CH4-PROT: RN8002.13
FMU-CH5: U8.6(A5)
FMU-CH5-PROT: RN8002.12
FMU-CH6: U8.7(A6)
FMU-CH6-PROT: RN8002.11
FMU-VDD_3V3: C33.P$1 U8.2(VCCA) U8.10(OE) U8.19(VCCB)
IO-CH1: U10.10(A8)
IO-CH1-PROT: RN8001.9
IO-CH2: U10.9(A7)
IO-CH2-PROT: RN8001.10
IO-CH3: U10.8(A6)
IO-CH3-PROT: RN8001.11
IO-CH4: U10.7(A5)
IO-CH4-PROT: RN8001.12
IO-CH5: U10.6(A4)
IO-CH5-PROT: RN8001.13
IO-CH6: U10.5(A3)
IO-CH6-PROT: RN8001.14
IO-CH7: U10.4(A2)
IO-CH7-PROT: RN8001.15
IO-CH8: U10.3(A1)
IO-CH8-PROT: RN8001.16
IO-VDD_3V3: C34.P$1 SW1.A1(EN) SW1.C2(VinB) U9.8(VCC) U10.1(VCCA) U10.2(DIR)
IO-VDD_5V5: SW1.A2(VinA)
PPM-SBUS-PROT: RN8002.10
PPM_INPUT: D3.C RN8002.7 U9.2(1A)
PWM_VOLT_SEL: SW1.B1(SEL)
RSSI_IN: R27.P$1
S.BUS_OUT: RN8002.9
~{SBUS_OUTPUT_EN}: U9.7(~{2OE})
SBUS_INPUT: U9.6(1Y)
SBUS_OUTPUT: U9.5(2A)
SBUS_UNPROTECTED: D4.C R27.P$2 RN8002.8 U9.3(2Y)
NetC35_P$1: C35.P$1 SW1.B2(Vout) U10.23(VCCB) U10.24(VCCB)
NetRN8001_1: RN8001.1 U10.21(B1)
NetRN8001_2: RN8001.2 U10.20(B2)
NetRN8001_3: RN8001.3 U10.19(B3)
NetRN8001_4: RN8001.4 U10.18(B4)
NetRN8001_5: RN8001.5 U10.17(B5)
NetRN8001_6: RN8001.6 U10.16(B6)
NetRN8001_7: RN8001.7 U10.15(B7)
NetRN8001_8: RN8001.8 U10.14(B8)
NetRN8002_1: RN8002.1 U8.20(B1)
NetRN8002_2: RN8002.2 U8.18(B2)
NetRN8002_3: RN8002.3 U8.17(B3)
NetRN8002_4: RN8002.4 U8.16(B4)
NetRN8002_5: RN8002.5 U8.15(B5)
NetRN8002_6: RN8002.6 U8.14(B6)

Not connected (* = marked no-connect by the designer): U8 8(A7) 9(A8) 12(B8) 13(B7)

### Notes on the sheet
- Servo outputs
- S.Bus in/out
- Please be aware, that the hardware that this schematic is used on, is only "GENUINE" if it is produced under the direct supervision of ProfiCNC.
- The design on this schematic, and only this schematic, is licenced as cc-by-sa 3.0 this license give NO RIGHTS beyound those expressly given under the terms of this license.
- This design schematic is a derivitive of "The Cube" By ProfiCNC pleas contact ProfiCNC for any Copyright or licencing enquiries
- https://creativecommons.org/licenses/by-sa/3.0/
- Please see
- https://github.com/proficnc/The-Cube
- for any licencing enquiries. I am easy to contact
- Drawn By:
- Verified for production by:
- Approved for release:
- Title
- Size:
- Date:
- A
- Number:
- Time:
- Revision:
- Sheet
- of
- File:

### Library data of the parts
C33-C35 = CAP0402: CAP CER 0.1UF 16V Y5V 0402; Value: 0u1
D3 D4 = DIODE-TVS: TVS DIODE 14VWM 40VC 0402; Value: 40v
R27 = RESISTOR0402-RES: RES 10K OHM 1/16W 1% 0402 SMD; Value: 10K
RN8001 RN8002 = 8R-NEXB2HV-220R: RES ARRAY 120 OHM 8 RES 1506; Value: 120R
U8 = TXS0108QFN20: IC XLATR VOLT-LVL 8B BDIR 20QFN
U9 = 74LVC2G240-TSSOP-8: IC INVERTER DUAL 4-INPUT 8TSSOP; Value: INV

## Sheet SD_USB_FMU_REV_2A.SchDoc: Cube Yellow and Cube Orange
size A3; Date: 18/08/2014 1:53:11 PM; Author: PR; DrawnBy: Philip Rowse; Engineer: Philip Rowse; Organization: ProfiCNC/Hex; Address3: VIC; Address4: Australia; Revision: A; SheetNumber: 8; SheetTotal: 10
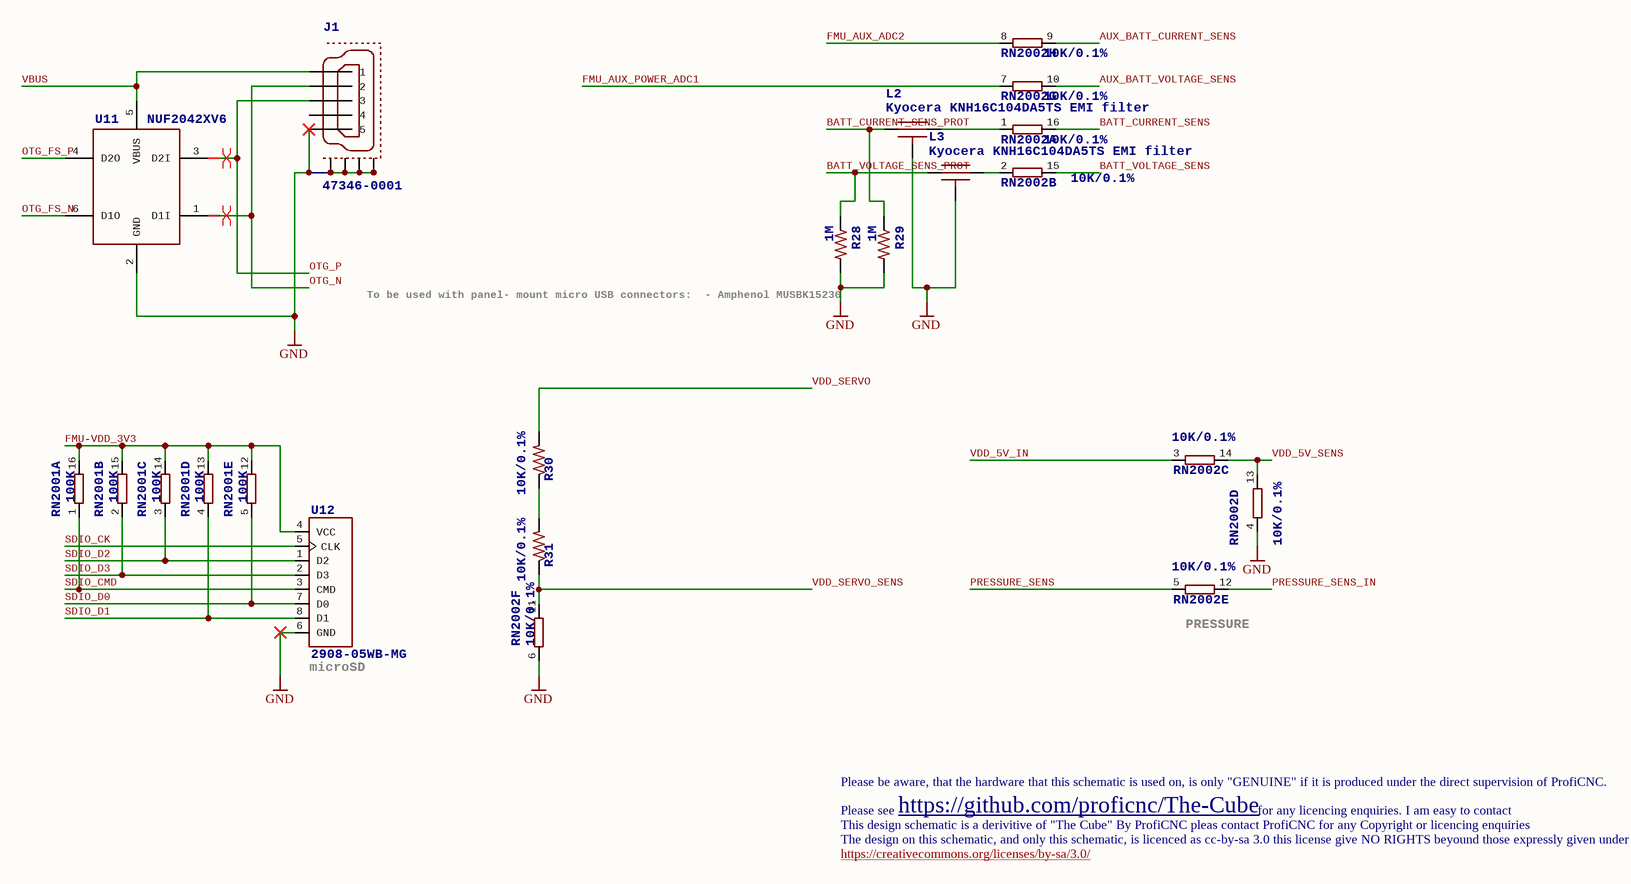
[diagram p7: SD_USB_FMU_REV_2A.SchDoc]

### Parts
J1  47346-0001  [MOLEX-47346-0001]
L2  Kyocera KNH16C104DA5TS EMI filter  [KYOCERA-KNH16-DA]
L3  Kyocera KNH16C104DA5TS EMI filter  [KYOCERA-KNH16-DA]
R28  1M  [0402-RES]
R29  1M  [0402-RES]
R30  10K/0.1%  [0402-RES]
R31  10K/0.1%  [0402-RES]
RN2001  100K  [EXB2HV]  (parts A,B,C,D,E of 8)
RN2002  10K/0.1%  [EXB2HV]  (parts A,B,C,D,E,F,G,H of 8)
U11  NUF2042XV6  [SOT563-6]
U12  2908-05WB-MG  [MICROSD]

### Nets
GND: J1.GND(5) J1.GND1 J1.GND2 J1.GND3 J1.GND4 L2.GND L3.GND R28.P$2 R29.P$2 RN2002.4 RN2002.6 U11.2(GND) U12.6(GND)
AUX_BATT_CURRENT_SENS: RN2002.9
AUX_BATT_VOLTAGE_SENS: RN2002.10
BATT_CURRENT_SENS: RN2002.16
BATT_CURRENT_SENS_PROT: L2.P$1 R29.P$1
BATT_VOLTAGE_SENS: RN2002.15
BATT_VOLTAGE_SENS_PROT: L3.P$1 R28.P$1
FMU-VDD_3V3: RN2001.12 RN2001.13 RN2001.14 RN2001.15 RN2001.16 U12.4(VCC)
FMU_AUX_ADC2: RN2002.8
FMU_AUX_POWER_ADC1: RN2002.7
OTG_FS_N: U11.6(D1O)
OTG_FS_P: U11.4(D2O)
OTG_N: J1.D-(2) U11.1(D1I)
OTG_P: J1.D+(3) U11.3(D2I)
PRESSURE_SENS: RN2002.5
PRESSURE_SENS_IN: RN2002.12
SDIO_CK: U12.5(CLK)
SDIO_CMD: RN2001.1 U12.3(CMD)
SDIO_D0: RN2001.5 U12.7(D0)
SDIO_D1: RN2001.4 U12.8(D1)
SDIO_D2: RN2001.3 U12.1(D2)
SDIO_D3: RN2001.2 U12.2(D3)
VBUS: J1.VBUS(1) U11.5(VBUS)
VDD_5V_IN: RN2002.3
VDD_5V_SENS: RN2002.13 RN2002.14
VDD_SERVO: R30.P$2
VDD_SERVO_SENS: R31.P$1 RN2002.11
NetL2_P$2: L2.P$2 RN2002.1
NetL3_P$2: L3.P$2 RN2002.2
NetR30_P$1: R30.P$1 R31.P$2

Not connected (* = marked no-connect by the designer): J1 ID(4)

### Layout directives
differential pair: OTG_N, OTG_P

### Notes on the sheet
- To be used with panel-
  mount micro USB connectors:
  - Amphenol MUSBK15230
- (near RN2002) PRESSURE
- (near U12) microSD
- Please be aware, that the hardware that this schematic is used on, is only "GENUINE" if it is produced under the direct supervision of ProfiCNC.
- The design on this schematic, and only this schematic, is licenced as cc-by-sa 3.0 this license give NO RIGHTS beyound those expressly given under the terms of this license.
- This design schematic is a derivitive of "The Cube" By ProfiCNC pleas contact ProfiCNC for any Copyright or licencing enquiries
- https://creativecommons.org/licenses/by-sa/3.0/
- Please see
- https://github.com/proficnc/The-Cube
- for any licencing enquiries. I am easy to contact
- Drawn By:
- Verified for production by:
- Approved for release:
- Title
- Size:
- Date:
- A
- Number:
- Time:
- Revision:
- Sheet
- of
- File:

### Library data of the parts
J1 = MOLEX-47346-0001: MICRO USB B, BOTTOM MOUNT
L2 L3 = KNH16C104DA5TS: FILTER CAP 0.1UF 2A 25V 0603; Value: 0u1
R28 R29 = RESISTOR0402-RES: RES 1M OHM 1/16W 1% 0402 SMD; Value: 1M
R30 R31 = RESISTOR0402-RES: RES 10K OHM 1/16W .1% 0402 SMD; Value: 10K
RN2001 = 8R-NEXB2HV-100K: RES ARRAY 100K OHM 8 RES 1506; Value: 100K
RN2002 = 8R-NEXB2HV-10K: RES ARRAY 10K OHM 8 RES 1506; Value: 10K
U11 = NUF2042XV6: IC FILTER USB ESD PROTECT SOT363
U12 = MICROSDSDI: CONN MICRO SD CARD PUSH-PUSH R/A

## Sheet SENSORS_FMU_REV_2A.SchDoc: Cube Yellow and Cube Orange
size A3; Date: 18/08/2014 1:53:16 PM; Author: PR; DrawnBy: Philip Rowse; Engineer: Philip Rowse; Organization: ProfiCNC/Hex; Address3: VIC; Address4: Australia; Revision: A; SheetNumber: 9; SheetTotal: 10
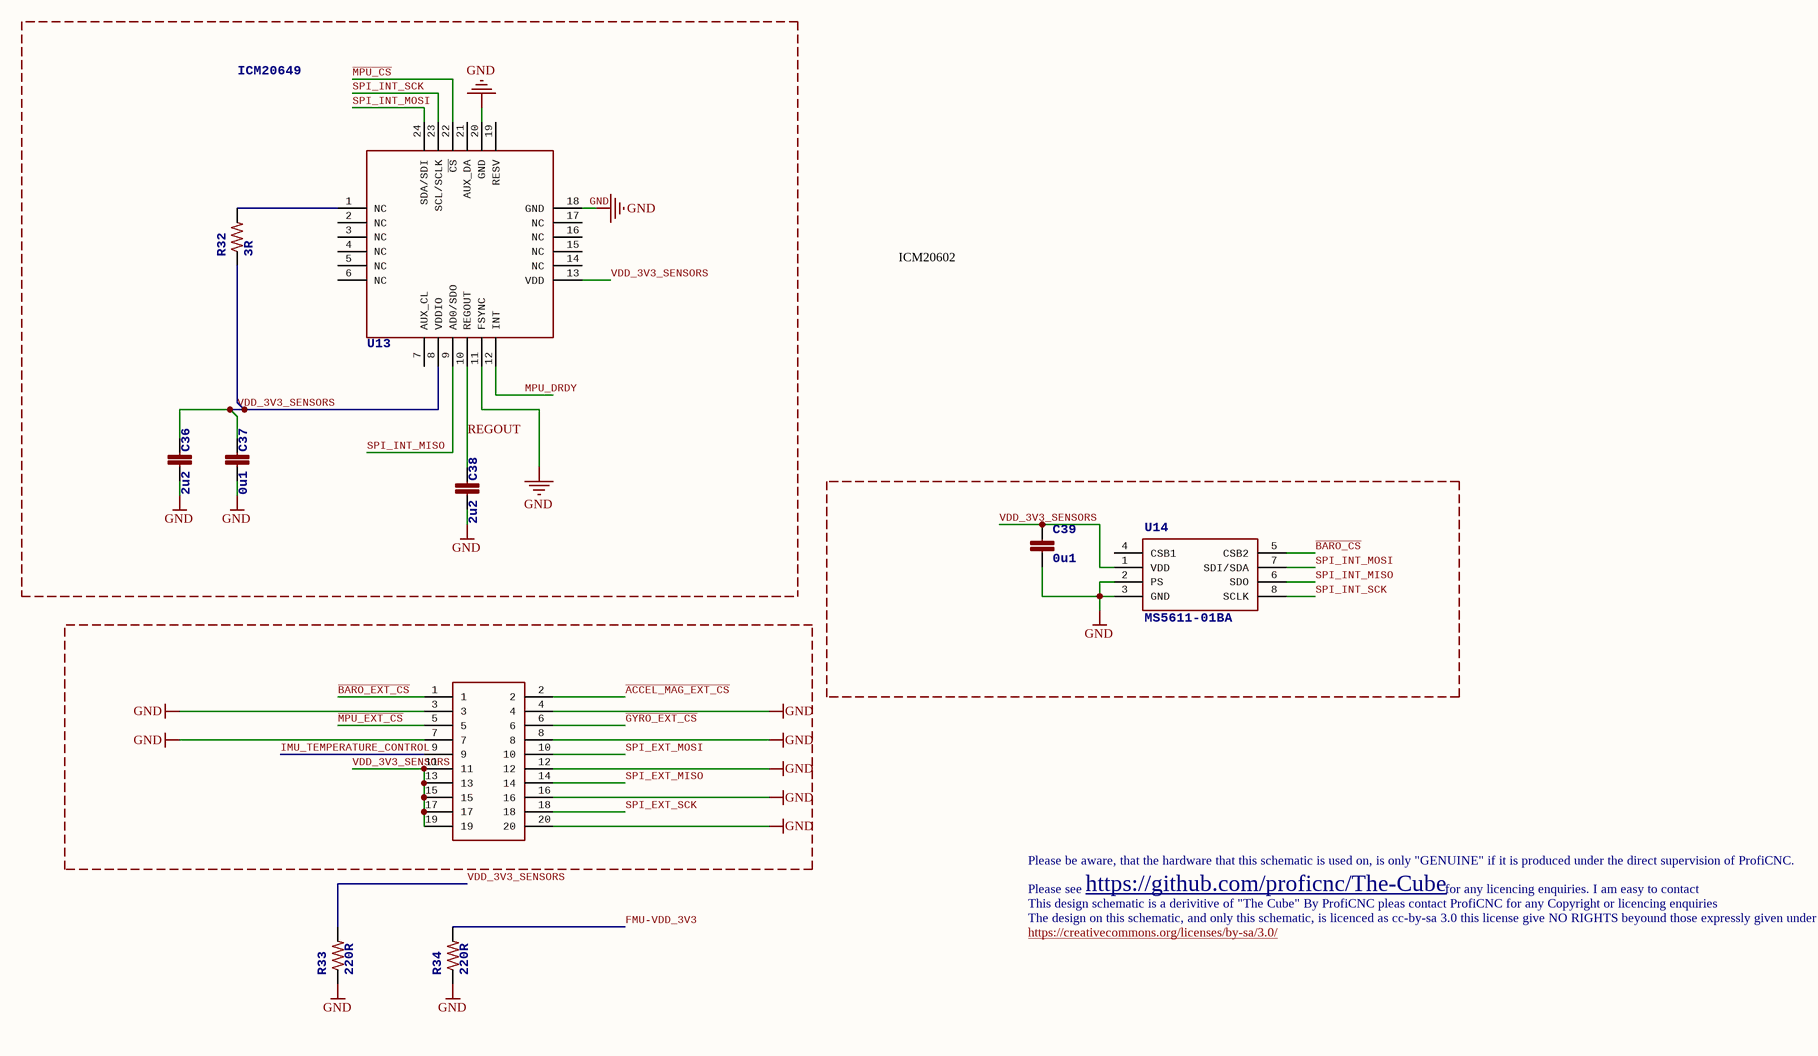
[diagram p8: SENSORS_FMU_REV_2A.SchDoc]

### Parts
C36  2u2  [0603-CAP]
C37  0u1  [0402-CAP]
C38  2u2  [0603-CAP]
C39  0u1  [0402-CAP]
R32  3R  [0201-RES]  (no BOM)
R33  220R  [0402-RES]
R34  220R  [0402-RES]
U13  ICM20649  [ICM20649]
U14  MS5611-01BA  [MS5611-01BA]
U$2  DF40C-20-DS  [DF-40C-20DS]  (value not drawn)

### Nets
GND: C36.P$2 C37.P$2 C38.P$2 C39.P$2 R33.P$1 R34.P$1 U13.11(FSYNC) U13.18(GND) U13.20(GND) U14.2(PS) U14.3(GND) U$2.3 U$2.4 U$2.7 U$2.8 U$2.12 U$2.16 U$2.20
~{ACCEL_MAG_EXT_CS}: U$2.2
~{BARO_CS}: U14.5(CSB2)
~{BARO_EXT_CS}: U$2.1
FMU-VDD_3V3: R34.P$2
~{GYRO_EXT_CS}: U$2.6
IMU_TEMPERATURE_CONTROL: U$2.9
~{MPU_CS}: U13.22(~{CS})
~{MPU_EXT_CS}: U$2.5
MPU_DRDY: U13.12(INT)
REGOUT: C38.P$1 U13.10(REGOUT)
SPI_EXT_MISO: U$2.14
SPI_EXT_MOSI: U$2.10
SPI_EXT_SCK: U$2.18
SPI_INT_MISO: U13.9(AD0/SDO) U14.6(SDO)
SPI_INT_MOSI: U13.24(SDA/SDI) U14.7(SDI/SDA)
SPI_INT_SCK: U13.23(SCL/SCLK) U14.8(SCLK)
VDD_3V3_SENSORS: C36.P$1 C37.P$1 C39.P$1 R32.1 R33.P$2 U13.8(VDDIO) U13.13(VDD) U14.1(VDD) U$2.11 U$2.13 U$2.15 U$2.17 U$2.19
NetR32_2: R32.2 U13.1(NC)

Not connected (* = marked no-connect by the designer): U13 2(NC) 3(NC) 4(NC) 5(NC) 6(NC) 7(AUX_CL) 14(NC) 15(NC) 16(NC) 17(NC) 19(RESV) 21(AUX_DA); U14 4(CSB1)

### Notes on the sheet
- ICM20602
  1428-1060-2-ND
  ICM20649
- Please be aware, that the hardware that this schematic is used on, is only "GENUINE" if it is produced under the direct supervision of ProfiCNC.
- The design on this schematic, and only this schematic, is licenced as cc-by-sa 3.0 this license give NO RIGHTS beyound those expressly given under the terms of this license.
- This design schematic is a derivitive of "The Cube" By ProfiCNC pleas contact ProfiCNC for any Copyright or licencing enquiries
- https://creativecommons.org/licenses/by-sa/3.0/
- Please see
- https://github.com/proficnc/The-Cube
- for any licencing enquiries. I am easy to contact
- Drawn By:
- Verified for production by:
- Approved for release:
- Title
- Size:
- Date:
- A
- Number:
- Time:
- Revision:
- Sheet
- of
- File:

### Library data of the parts
C36 C38 = CAP0603: CAP CER 2.2UF 16V 10% X6S 0603; Value: 2u2
C37 C39 = CAP0402: CAP CER 0.1UF 16V Y5V 0402; Value: 0u1
R32 = RESISTOR0402-RES: RES 3OHM 1/16W 1% 0201 SMD
R33 R34 = RESISTOR0402-RES: RES 220 OHM 1/16W 1% 0402 SMD; Value: 220R
U14 = MS5611-01BA: Board Mount Pressure Sensors; Value: 10-1200mbar
U$2 = DF40C-20-DS: CONN RCPT 20POS 0.4MM SMD GOLD

## Sheet SERIAL_FMU_REV_2A.SchDoc: Cube Yellow and Cube Orange
size A3; Date: 18/08/2014 1:53:13 PM; Author: PR; DrawnBy: Philip Rowse; Engineer: Philip Rowse; Organization: ProfiCNC/Hex; Address3: VIC; Address4: Australia; Revision: A; SheetNumber: 10; SheetTotal: 10
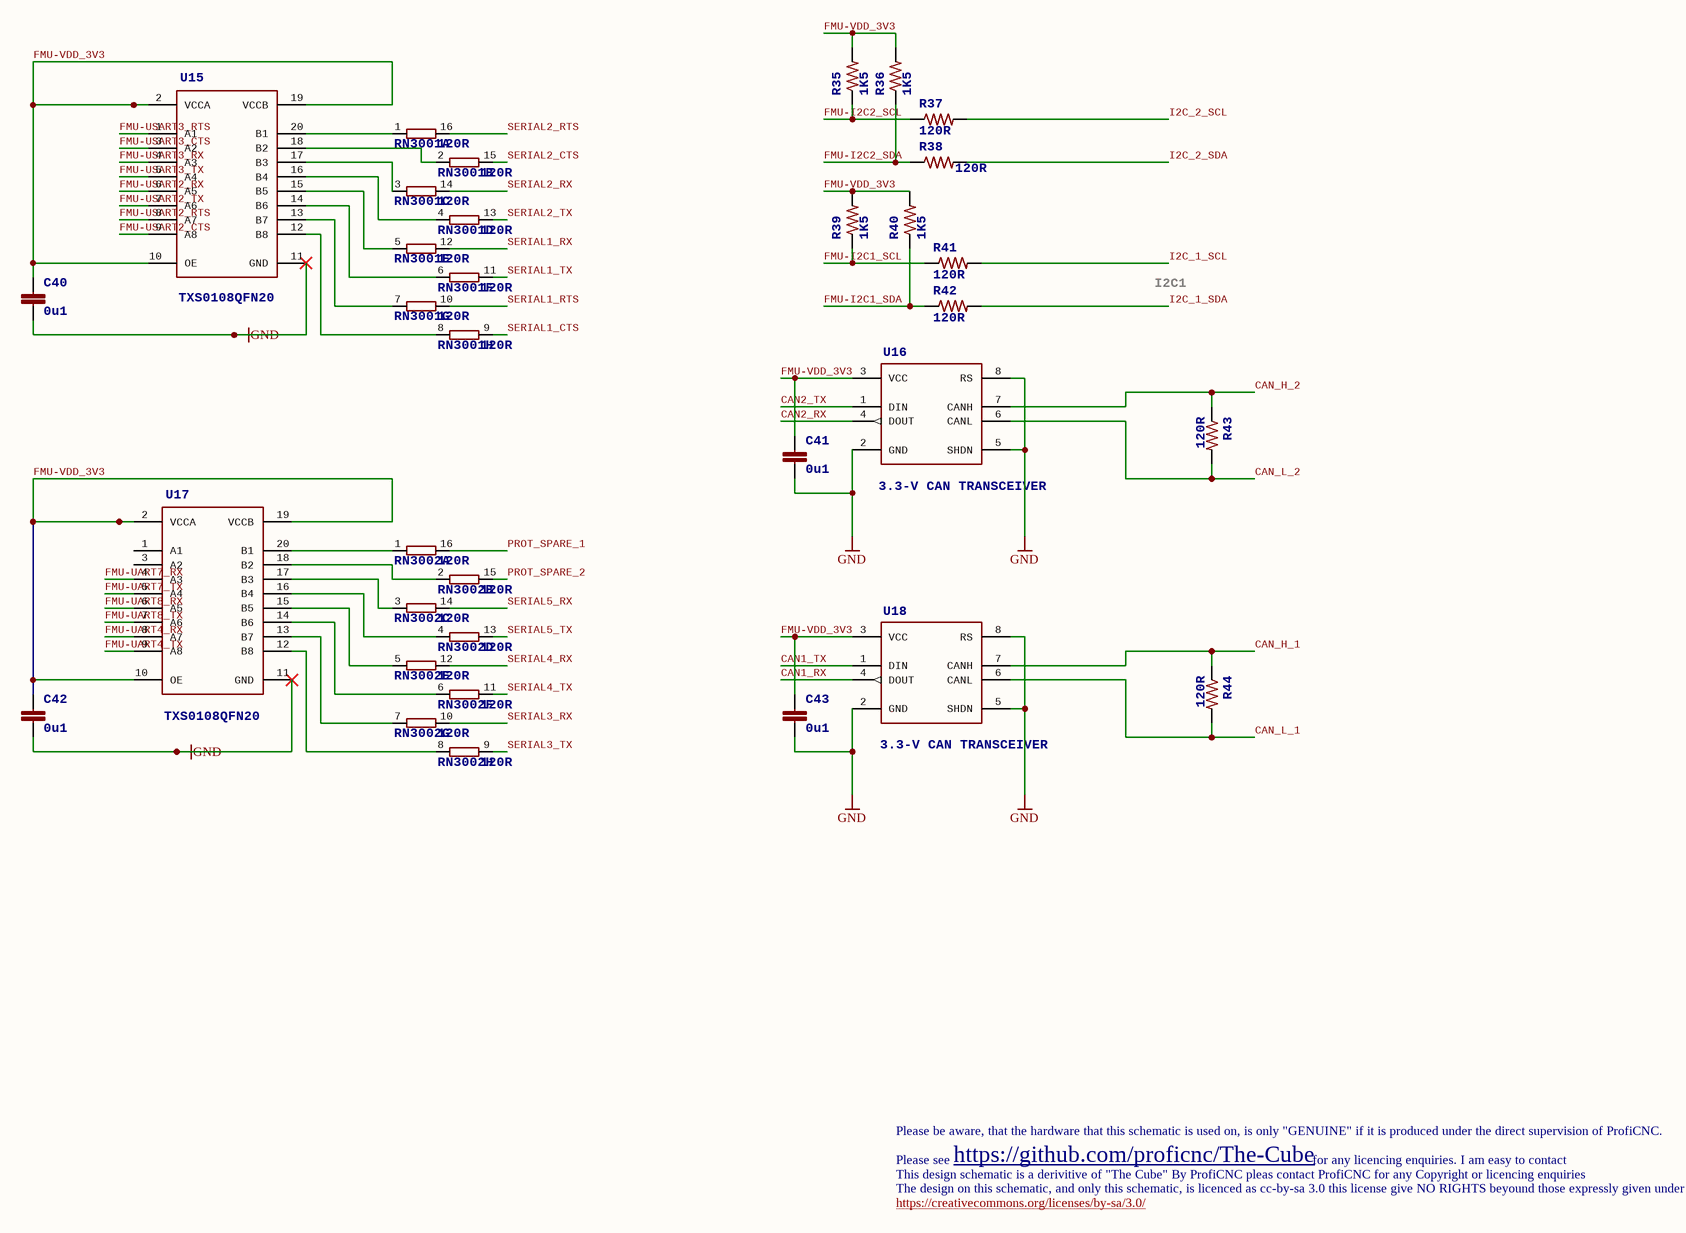
[diagram p9: SERIAL_FMU_REV_2A.SchDoc]

### Parts
C40  0u1  [0402-CAP]
C41  0u1  [0402-CAP]
C42  0u1  [0402-CAP]
C43  0u1  [0402-CAP]
R35  1K5  [0402-RES]
R36  1K5  [0402-RES]
R37  120R  [0402-RES]
R38  120R  [0402-RES]
R39  1K5  [0402-RES]
R40  1K5  [0402-RES]
R41  120R  [0402-RES]
R42  120R  [0402-RES]
R43  120R  [0402-RES]
R44  120R  [0402-RES]
RN3001  120R  [EXB2HV]  (parts A,B,C,D,E,F,G,H of 8)
RN3002  120R  [EXB2HV]  (parts A,B,C,D,E,F,G,H of 8)
U15  TXS0108QFN20  [QFN20-RGY]
U16  3.3-V CAN TRANSCEIVER  [SOT23-8]
U17  TXS0108QFN20  [QFN20-RGY]
U18  3.3-V CAN TRANSCEIVER  [SOT23-8]

### Nets
GND: C40.P$2 C41.P$2 C42.P$2 C43.P$2 U15.11(GND) U16.2(GND) U16.5(SHDN) U16.8(RS) U17.11(GND) U18.2(GND) U18.5(SHDN) U18.8(RS)
CAN1_RX: U18.4(DOUT)
CAN1_TX: U18.1(DIN)
CAN2_RX: U16.4(DOUT)
CAN2_TX: U16.1(DIN)
CAN_H_1: R44.P$1 U18.7(CANH)
CAN_H_2: R43.P$1 U16.7(CANH)
CAN_L_1: R44.P$2 U18.6(CANL)
CAN_L_2: R43.P$2 U16.6(CANL)
FMU-I2C1_SCL: R39.P$1 R41.P$1
FMU-I2C1_SDA: R40.P$1 R42.P$1
FMU-I2C2_SCL: R35.P$1 R37.P$1
FMU-I2C2_SDA: R36.P$1 R38.P$1
FMU-UART4_RX: U17.8(A7)
FMU-UART4_TX: U17.9(A8)
FMU-UART7_RX: U17.4(A3)
FMU-UART7_TX: U17.5(A4)
FMU-UART8_RX: U17.6(A5)
FMU-UART8_TX: U17.7(A6)
FMU-USART2_CTS: U15.9(A8)
FMU-USART2_RTS: U15.8(A7)
FMU-USART2_RX: U15.6(A5)
FMU-USART2_TX: U15.7(A6)
FMU-USART3_CTS: U15.3(A2)
FMU-USART3_RTS: U15.1(A1)
FMU-USART3_RX: U15.4(A3)
FMU-USART3_TX: U15.5(A4)
FMU-VDD_3V3: C40.P$1 C41.P$1 C42.P$1 C43.P$1 R35.P$2 R36.P$2 R39.P$2 R40.P$2 U15.2(VCCA) U15.10(OE) U15.19(VCCB) U16.3(VCC) U17.2(VCCA) U17.10(OE) U17.19(VCCB) U18.3(VCC)
I2C_1_SCL: R41.P$2
I2C_1_SDA: R42.P$2
I2C_2_SCL: R37.P$2
I2C_2_SDA: R38.P$2
PROT_SPARE_1: RN3002.16
PROT_SPARE_2: RN3002.15
SERIAL1_CTS: RN3001.9
SERIAL1_RTS: RN3001.10
SERIAL1_RX: RN3001.12
SERIAL1_TX: RN3001.11
SERIAL2_CTS: RN3001.15
SERIAL2_RTS: RN3001.16
SERIAL2_RX: RN3001.14
SERIAL2_TX: RN3001.13
SERIAL3_RX: RN3002.10
SERIAL3_TX: RN3002.9
SERIAL4_RX: RN3002.12
SERIAL4_TX: RN3002.11
SERIAL5_RX: RN3002.14
SERIAL5_TX: RN3002.13
NetRN3001_1: RN3001.1 U15.20(B1)
NetRN3001_2: RN3001.2 U15.18(B2)
NetRN3001_3: RN3001.3 U15.17(B3)
NetRN3001_4: RN3001.4 U15.16(B4)
NetRN3001_5: RN3001.5 U15.15(B5)
NetRN3001_6: RN3001.6 U15.14(B6)
NetRN3001_7: RN3001.7 U15.13(B7)
NetRN3001_8: RN3001.8 U15.12(B8)
NetRN3002_1: RN3002.1 U17.20(B1)
NetRN3002_2: RN3002.2 U17.18(B2)
NetRN3002_3: RN3002.3 U17.17(B3)
NetRN3002_4: RN3002.4 U17.16(B4)
NetRN3002_5: RN3002.5 U17.15(B5)
NetRN3002_6: RN3002.6 U17.14(B6)
NetRN3002_7: RN3002.7 U17.13(B7)
NetRN3002_8: RN3002.8 U17.12(B8)

Not connected (* = marked no-connect by the designer): U17 1(A1) 3(A2)

### Notes on the sheet
- I2C1
- Please be aware, that the hardware that this schematic is used on, is only "GENUINE" if it is produced under the direct supervision of ProfiCNC.
- The design on this schematic, and only this schematic, is licenced as cc-by-sa 3.0 this license give NO RIGHTS beyound those expressly given under the terms of this license.
- This design schematic is a derivitive of "The Cube" By ProfiCNC pleas contact ProfiCNC for any Copyright or licencing enquiries
- https://creativecommons.org/licenses/by-sa/3.0/
- Please see
- https://github.com/proficnc/The-Cube
- for any licencing enquiries. I am easy to contact
- Drawn By:
- Verified for production by:
- Approved for release:
- Title
- Size:
- Date:
- A
- Number:
- Time:
- Revision:
- Sheet
- of
- File:

### Library data of the parts
C40-C43 = CAP0402: CAP CER 0.1UF 16V Y5V 0402; Value: 0u1
R35 R36 R39 R40 = RESISTOR0402-RES: RES 1.5K OHM 1/16W 1% 0402 SMD; Value: 1K5
R37 R38 R41-R44 = RESISTOR0402-RES: RES 120 OHM 1/16W 1% 0402 SMD; Value: 120R
RN3001 RN3002 = 8R-NEXB2HV-120R: RES ARRAY 120 OHM 8 RES 1506; Value: 120R
U15 U17 = TXS0108QFN20: IC XLATR VOLT-LVL 8B BDIR 20QFN
U16 U18 = MAX3051MAX3051EKA: IC TXRX CAN 1MBPS SOT23-8; Value: CAN

## Nets that join several sheets
GND: 80PIN_FMU_REV_2A (U$1.13 U$1.15 U$1.GND), FMU_FMU_REV_2A (7 pins), FMU_Power_FMU_REV_2A (25 pins), IO_FMU_REV_2A (16 pins), IO_PWR_FMU_REV_2A (13 pins), LEDs_FMU_REV_2A (Q2.2 R26.P$2), PWM_PPM_FMU_REV_2A (13 pins), SD_USB_FMU_REV_2A (13 pins), SENSORS_FMU_REV_2A (18 pins), SERIAL_FMU_REV_2A (12 pins)
~{ACCEL_MAG_EXT_CS}: FMU_FMU_REV_2A (U1001.9), SENSORS_FMU_REV_2A (U$2.2)
ALARM: 80PIN_FMU_REV_2A (U$1.24), FMU_FMU_REV_2A (U1001.77)
AUX_BATT_CURRENT_SENS: 80PIN_FMU_REV_2A (U$1.25), SD_USB_FMU_REV_2A (RN2002.9)
AUX_BATT_VOLTAGE_SENS: 80PIN_FMU_REV_2A (U$1.23), SD_USB_FMU_REV_2A (RN2002.10)
~{BARO_CS}: FMU_FMU_REV_2A (U1001.88), SENSORS_FMU_REV_2A (U14.5)
~{BARO_EXT_CS}: FMU_FMU_REV_2A (U1001.8), SENSORS_FMU_REV_2A (U$2.1)
BATT_CURRENT_SENS: FMU_FMU_REV_2A (U1001.26), SD_USB_FMU_REV_2A (RN2002.16)
BATT_CURRENT_SENS_PROT: 80PIN_FMU_REV_2A (U$1.49), SD_USB_FMU_REV_2A (L2.P$1 R29.P$1)
BATT_VOLTAGE_SENS: FMU_FMU_REV_2A (U1001.25), SD_USB_FMU_REV_2A (RN2002.15)
BATT_VOLTAGE_SENS_PROT: 80PIN_FMU_REV_2A (U$1.47), SD_USB_FMU_REV_2A (L3.P$1 R28.P$1)
CAN1_RX: FMU_FMU_REV_2A (U1001.81), SERIAL_FMU_REV_2A (U18.4)
CAN1_TX: FMU_FMU_REV_2A (U1001.82), SERIAL_FMU_REV_2A (U18.1)
CAN2_RX: FMU_FMU_REV_2A (U1001.51), SERIAL_FMU_REV_2A (U16.4)
CAN2_TX: FMU_FMU_REV_2A (U1001.92), SERIAL_FMU_REV_2A (U16.1)
CAN_H_1: 80PIN_FMU_REV_2A (U$1.79), SERIAL_FMU_REV_2A (R44.P$1 U18.7)
CAN_H_2: 80PIN_FMU_REV_2A (U$1.41), SERIAL_FMU_REV_2A (R43.P$1 U16.7)
CAN_L_1: 80PIN_FMU_REV_2A (U$1.77), SERIAL_FMU_REV_2A (R44.P$2 U18.6)
CAN_L_2: 80PIN_FMU_REV_2A (U$1.39), SERIAL_FMU_REV_2A (R43.P$2 U16.6)
~{EXTERN_CS}: 80PIN_FMU_REV_2A (U$1.5), FMU_FMU_REV_2A (U1001.36)
EXTERN_DRDY: 80PIN_FMU_REV_2A (U$1.11), FMU_FMU_REV_2A (U1001.35)
~{FMU-LED_AMBER}: 80PIN_FMU_REV_2A (U$1.2), FMU_FMU_REV_2A (U1001.43), LEDs_FMU_REV_2A (R21.P$1)
FMU-!RESET: 80PIN_FMU_REV_2A (U$1.7), FMU_Power_FMU_REV_2A (C21.P$2 U3.3 U1001.14)
FMU-CH1: FMU_FMU_REV_2A (U1001.45), PWM_PPM_FMU_REV_2A (U8.1)
FMU-CH1-PROT: 80PIN_FMU_REV_2A (U$1.50), PWM_PPM_FMU_REV_2A (RN8002.16)
FMU-CH2: FMU_FMU_REV_2A (U1001.44), PWM_PPM_FMU_REV_2A (U8.3)
FMU-CH2-PROT: 80PIN_FMU_REV_2A (U$1.52), PWM_PPM_FMU_REV_2A (RN8002.15)
FMU-CH3: FMU_FMU_REV_2A (U1001.42), PWM_PPM_FMU_REV_2A (U8.4)
FMU-CH3-PROT: 80PIN_FMU_REV_2A (U$1.54), PWM_PPM_FMU_REV_2A (RN8002.14)
FMU-CH4: FMU_FMU_REV_2A (U1001.40), PWM_PPM_FMU_REV_2A (U8.5)
FMU-CH4-PROT: 80PIN_FMU_REV_2A (U$1.56), PWM_PPM_FMU_REV_2A (RN8002.13)
FMU-CH5: FMU_FMU_REV_2A (U1001.60), PWM_PPM_FMU_REV_2A (U8.6)
FMU-CH5-PROT: 80PIN_FMU_REV_2A (U$1.58), PWM_PPM_FMU_REV_2A (RN8002.12)
FMU-CH6: FMU_FMU_REV_2A (U1001.61), PWM_PPM_FMU_REV_2A (U8.7)
FMU-CH6-PROT: 80PIN_FMU_REV_2A (U$1.60), PWM_PPM_FMU_REV_2A (RN8002.11)
FMU-I2C1_SCL: FMU_FMU_REV_2A (U1001.95), SERIAL_FMU_REV_2A (R39.P$1 R41.P$1)
FMU-I2C1_SDA: FMU_FMU_REV_2A (U1001.96), SERIAL_FMU_REV_2A (R40.P$1 R42.P$1)
FMU-I2C2_SCL: FMU_FMU_REV_2A (U1001.47), SERIAL_FMU_REV_2A (R35.P$1 R37.P$1)
FMU-I2C2_SDA: FMU_FMU_REV_2A (U1001.48), SERIAL_FMU_REV_2A (R36.P$1 R38.P$1)
FMU-SWCLK: 80PIN_FMU_REV_2A (FMU-SWCLK.P$1 U$1.3), FMU_FMU_REV_2A (U1001.76)
FMU-SWDIO: 80PIN_FMU_REV_2A (FMU-SWDIO.P$1 U$1.1), FMU_FMU_REV_2A (U1001.72)
FMU-UART4_RX: FMU_FMU_REV_2A (U1001.24), SERIAL_FMU_REV_2A (U17.8)
FMU-UART4_TX: FMU_FMU_REV_2A (U1001.23), SERIAL_FMU_REV_2A (U17.9)
FMU-UART7_RX: FMU_FMU_REV_2A (U1001.38), SERIAL_FMU_REV_2A (U17.4)
FMU-UART7_TX: FMU_FMU_REV_2A (U1001.39), SERIAL_FMU_REV_2A (U17.5)
FMU-UART8_RX: FMU_FMU_REV_2A (U1001.97), SERIAL_FMU_REV_2A (U17.6)
FMU-UART8_TX: FMU_FMU_REV_2A (U1001.98), SERIAL_FMU_REV_2A (U17.7)
FMU-USART2_CTS: FMU_FMU_REV_2A (U1001.84), SERIAL_FMU_REV_2A (U15.9)
FMU-USART2_RTS: FMU_FMU_REV_2A (U1001.85), SERIAL_FMU_REV_2A (U15.8)
FMU-USART2_RX: FMU_FMU_REV_2A (U1001.87), SERIAL_FMU_REV_2A (U15.6)
FMU-USART2_TX: FMU_FMU_REV_2A (U1001.86), SERIAL_FMU_REV_2A (U15.7)
FMU-USART3_CTS: FMU_FMU_REV_2A (U1001.58), SERIAL_FMU_REV_2A (U15.3)
FMU-USART3_RTS: FMU_FMU_REV_2A (U1001.59), SERIAL_FMU_REV_2A (U15.1)
FMU-USART3_RX: FMU_FMU_REV_2A (U1001.56), SERIAL_FMU_REV_2A (U15.4)
FMU-USART3_TX: FMU_FMU_REV_2A (U1001.55), SERIAL_FMU_REV_2A (U15.5)
FMU-VDD_3V3: 80PIN_FMU_REV_2A (FMU-VDD_3V3.P$1), FMU_FMU_REV_2A (C3.P$1 U2.3 U2.7 U2.8), FMU_Power_FMU_REV_2A (13 pins), IO_FMU_REV_2A (R14.P$2), PWM_PPM_FMU_REV_2A (C33.P$1 U8.2 U8.10 U8.19), SD_USB_FMU_REV_2A (6 pins), SENSORS_FMU_REV_2A (R34.P$2), SERIAL_FMU_REV_2A (16 pins)
FMU_AUX_ADC2: FMU_FMU_REV_2A (U1001.33), SD_USB_FMU_REV_2A (RN2002.8)
FMU_AUX_POWER_ADC1: FMU_FMU_REV_2A (U1001.18), SD_USB_FMU_REV_2A (RN2002.7)
~{GYRO_EXT_CS}: FMU_FMU_REV_2A (U1001.7), SENSORS_FMU_REV_2A (U$2.6)
I2C_1_SCL: 80PIN_FMU_REV_2A (U$1.37), SERIAL_FMU_REV_2A (R41.P$2)
I2C_1_SDA: 80PIN_FMU_REV_2A (U$1.35), SERIAL_FMU_REV_2A (R42.P$2)
I2C_2_SCL: 80PIN_FMU_REV_2A (U$1.6), SERIAL_FMU_REV_2A (R37.P$2)
I2C_2_SDA: 80PIN_FMU_REV_2A (U$1.4), SERIAL_FMU_REV_2A (R38.P$2)
I/O_POWER_BREATHING: IO_FMU_REV_2A (U7001.32), LEDs_FMU_REV_2A (R22.P$2)
~{IO-LED_AMBER}: IO_FMU_REV_2A (U7001.28), LEDs_FMU_REV_2A (R24.P$1)
~{IO-LED_SAFET_PROT}: 80PIN_FMU_REV_2A (U$1.28), LEDs_FMU_REV_2A (R25.P$1)
~{IO-LED_SAFETY}: IO_FMU_REV_2A (U7001.26), LEDs_FMU_REV_2A (R25.P$2)
IMU_TEMPERATURE_CONTROL: IO_FMU_REV_2A (R15.P$2 U7001.27), SENSORS_FMU_REV_2A (U$2.9)
IO-!RESET: 80PIN_FMU_REV_2A (U$1.75), IO_FMU_REV_2A (C27.P$2 U7001.7), IO_PWR_FMU_REV_2A (U6.3)
IO-!VDD_SERVO_IN_FAULT: IO_FMU_REV_2A (U7001.38), IO_PWR_FMU_REV_2A (U7.4)
IO-CH1: IO_FMU_REV_2A (U7001.10), PWM_PPM_FMU_REV_2A (U10.10)
IO-CH1-PROT: 80PIN_FMU_REV_2A (U$1.80), PWM_PPM_FMU_REV_2A (RN8001.9)
IO-CH2: IO_FMU_REV_2A (U7001.11), PWM_PPM_FMU_REV_2A (U10.9)
IO-CH2-PROT: 80PIN_FMU_REV_2A (U$1.78), PWM_PPM_FMU_REV_2A (RN8001.10)
IO-CH3: IO_FMU_REV_2A (U7001.45), PWM_PPM_FMU_REV_2A (U10.8)
IO-CH3-PROT: 80PIN_FMU_REV_2A (U$1.76), PWM_PPM_FMU_REV_2A (RN8001.11)
IO-CH4: IO_FMU_REV_2A (U7001.46), PWM_PPM_FMU_REV_2A (U10.7)
IO-CH4-PROT: 80PIN_FMU_REV_2A (U$1.74), PWM_PPM_FMU_REV_2A (RN8001.12)
IO-CH5: IO_FMU_REV_2A (U7001.16), PWM_PPM_FMU_REV_2A (U10.6)
IO-CH5-PROT: 80PIN_FMU_REV_2A (U$1.72), PWM_PPM_FMU_REV_2A (RN8001.13)
IO-CH6: IO_FMU_REV_2A (U7001.17), PWM_PPM_FMU_REV_2A (U10.5)
IO-CH6-PROT: 80PIN_FMU_REV_2A (U$1.70), PWM_PPM_FMU_REV_2A (RN8001.14)
IO-CH7: IO_FMU_REV_2A (U7001.18), PWM_PPM_FMU_REV_2A (U10.4)
IO-CH7-PROT: 80PIN_FMU_REV_2A (U$1.68), PWM_PPM_FMU_REV_2A (RN8001.15)
IO-CH8: IO_FMU_REV_2A (U7001.19), PWM_PPM_FMU_REV_2A (U10.3)
IO-CH8-PROT: 80PIN_FMU_REV_2A (U$1.66), PWM_PPM_FMU_REV_2A (RN8001.16)
IO-SWCLK: 80PIN_FMU_REV_2A (IO-SWCLK.P$1 U$1.71), IO_FMU_REV_2A (U7001.37)
IO-SWDIO: 80PIN_FMU_REV_2A (IO-SWDIO.P$1 U$1.69), IO_FMU_REV_2A (U7001.34)
IO-USART1_RX_SPECTRUM_DSM: 80PIN_FMU_REV_2A (U$1.48), IO_FMU_REV_2A (R9.P$2 U7001.31)
IO-USART1_TX: 80PIN_FMU_REV_2A (U$1.46), FMU_FMU_REV_2A (R1.P$2), IO_FMU_REV_2A (U7001.30)
IO-VDD_3V3: 80PIN_FMU_REV_2A (IO-VDD_3V3.P$1 U$1.26), IO_FMU_REV_2A (8 pins), IO_PWR_FMU_REV_2A (C30.P$1 C31.P$1 U6.7), PWM_PPM_FMU_REV_2A (6 pins)
IO-VDD_5V5: IO_PWR_FMU_REV_2A (5 pins), LEDs_FMU_REV_2A (LED3.A R18.P$2 R20.P$2), PWM_PPM_FMU_REV_2A (SW1.A2)
~{MPU_CS}: FMU_FMU_REV_2A (U1001.17), SENSORS_FMU_REV_2A (U13.22)
~{MPU_EXT_CS}: FMU_FMU_REV_2A (U1001.3), SENSORS_FMU_REV_2A (U$2.5)
MPU_DRDY: FMU_FMU_REV_2A (U1001.62), SENSORS_FMU_REV_2A (U13.12)
OTG_FS_N: FMU_FMU_REV_2A (U1001.70), SD_USB_FMU_REV_2A (U11.6)
OTG_FS_P: FMU_FMU_REV_2A (U1001.71), SD_USB_FMU_REV_2A (U11.4)
OTG_N: 80PIN_FMU_REV_2A (U$1.33), SD_USB_FMU_REV_2A (J1.D- U11.1)
OTG_P: 80PIN_FMU_REV_2A (U$1.31), SD_USB_FMU_REV_2A (J1.D+ U11.3)
PPM-SBUS-PROT: 80PIN_FMU_REV_2A (U$1.62), PWM_PPM_FMU_REV_2A (RN8002.10)
PPM_INPUT: IO_FMU_REV_2A (U7001.29), PWM_PPM_FMU_REV_2A (D3.C RN8002.7 U9.2)
PRESSURE_SENS: FMU_FMU_REV_2A (U1001.34), SD_USB_FMU_REV_2A (RN2002.5)
PRESSURE_SENS_IN: 80PIN_FMU_REV_2A (U$1.21), SD_USB_FMU_REV_2A (RN2002.12)
PWM_VOLT_SEL: FMU_FMU_REV_2A (U1001.90), PWM_PPM_FMU_REV_2A (SW1.B1)
RSSI_IN: IO_FMU_REV_2A (U7001.15 U7001.33), PWM_PPM_FMU_REV_2A (R27.P$1)
S.BUS_OUT: 80PIN_FMU_REV_2A (U$1.64), PWM_PPM_FMU_REV_2A (RN8002.9)
~{SBUS_OUTPUT_EN}: IO_FMU_REV_2A (U7001.40), PWM_PPM_FMU_REV_2A (U9.7)
SAFETY: 80PIN_FMU_REV_2A (U$1.17), IO_FMU_REV_2A (U7001.41), LEDs_FMU_REV_2A (R26.P$1)
SBUS_INPUT: IO_FMU_REV_2A (U7001.22), PWM_PPM_FMU_REV_2A (U9.6)
SBUS_OUTPUT: IO_FMU_REV_2A (U7001.21), PWM_PPM_FMU_REV_2A (U9.5)
SDIO_CK: FMU_FMU_REV_2A (U1001.80), SD_USB_FMU_REV_2A (U12.5)
SDIO_CMD: FMU_FMU_REV_2A (U1001.83), SD_USB_FMU_REV_2A (RN2001.1 U12.3)
SDIO_D0: FMU_FMU_REV_2A (U1001.65), SD_USB_FMU_REV_2A (RN2001.5 U12.7)
SDIO_D1: FMU_FMU_REV_2A (U1001.66), SD_USB_FMU_REV_2A (RN2001.4 U12.8)
SDIO_D2: FMU_FMU_REV_2A (U1001.78), SD_USB_FMU_REV_2A (RN2001.3 U12.1)
SDIO_D3: FMU_FMU_REV_2A (U1001.79), SD_USB_FMU_REV_2A (RN2001.2 U12.2)
SERIAL1_CTS: 80PIN_FMU_REV_2A (U$1.44), SERIAL_FMU_REV_2A (RN3001.9)
SERIAL1_RTS: 80PIN_FMU_REV_2A (U$1.42), SERIAL_FMU_REV_2A (RN3001.10)
SERIAL1_RX: 80PIN_FMU_REV_2A (U$1.38), SERIAL_FMU_REV_2A (RN3001.12)
SERIAL1_TX: 80PIN_FMU_REV_2A (U$1.40), SERIAL_FMU_REV_2A (RN3001.11)
SERIAL2_CTS: 80PIN_FMU_REV_2A (U$1.32), SERIAL_FMU_REV_2A (RN3001.15)
SERIAL2_RTS: 80PIN_FMU_REV_2A (U$1.30), SERIAL_FMU_REV_2A (RN3001.16)
SERIAL2_RX: 80PIN_FMU_REV_2A (U$1.34), SERIAL_FMU_REV_2A (RN3001.14)
SERIAL2_TX: 80PIN_FMU_REV_2A (U$1.36), SERIAL_FMU_REV_2A (RN3001.13)
SERIAL3_RX: 80PIN_FMU_REV_2A (U$1.20), SERIAL_FMU_REV_2A (RN3002.10)
SERIAL3_TX: 80PIN_FMU_REV_2A (U$1.22), SERIAL_FMU_REV_2A (RN3002.9)
SERIAL4_RX: 80PIN_FMU_REV_2A (U$1.16), SERIAL_FMU_REV_2A (RN3002.12)
SERIAL4_TX: 80PIN_FMU_REV_2A (U$1.18), SERIAL_FMU_REV_2A (RN3002.11)
SERIAL5_RX: 80PIN_FMU_REV_2A (RX5.P$1 U$1.12), SERIAL_FMU_REV_2A (RN3002.14)
SERIAL5_TX: 80PIN_FMU_REV_2A (TX5.P$1 U$1.14), SERIAL_FMU_REV_2A (RN3002.13)
SERIAL_FMU_TO_IO: FMU_FMU_REV_2A (U1001.63), IO_FMU_REV_2A (R10.P$2)
SERIAL_IO_TO_FMU: FMU_FMU_REV_2A (U1001.64), IO_FMU_REV_2A (R8.P$2)
SPI_EXT_MISO: 80PIN_FMU_REV_2A (U$1.67), FMU_FMU_REV_2A (U1001.4), SENSORS_FMU_REV_2A (U$2.14)
SPI_EXT_MOSI: 80PIN_FMU_REV_2A (U$1.51), FMU_FMU_REV_2A (U1001.5), SENSORS_FMU_REV_2A (U$2.10)
SPI_EXT_SCK: 80PIN_FMU_REV_2A (U$1.73), FMU_FMU_REV_2A (U1001.1), SENSORS_FMU_REV_2A (U$2.18)
SPI_INT_MISO: FMU_FMU_REV_2A (U1001.31), SENSORS_FMU_REV_2A (U13.9 U14.6)
SPI_INT_MOSI: FMU_FMU_REV_2A (U1001.32), SENSORS_FMU_REV_2A (U13.24 U14.7)
SPI_INT_SCK: FMU_FMU_REV_2A (U1001.30), SENSORS_FMU_REV_2A (U13.23 U14.8)
~{VBUS_VALID}: 80PIN_FMU_REV_2A (U$1.59), FMU_FMU_REV_2A (U1001.15)
~{VDD_5V_HIPOWER_OC}: 80PIN_FMU_REV_2A (U$1.45), FMU_FMU_REV_2A (U1001.41)
~{VDD_5V_PERIPH_EN}: 80PIN_FMU_REV_2A (U$1.27), FMU_FMU_REV_2A (U1001.67)
~{VDD_5V_PERIPH_OC}: 80PIN_FMU_REV_2A (U$1.43), FMU_FMU_REV_2A (U1001.46)
~{VDD_BACKUP_VALID}: 80PIN_FMU_REV_2A (U$1.57), FMU_FMU_REV_2A (U1001.93), IO_FMU_REV_2A (R13.P$2)
~{VDD_BRICK_VALID}: 80PIN_FMU_REV_2A (U$1.55), FMU_FMU_REV_2A (U1001.91), IO_FMU_REV_2A (R12.P$2)
VBAT: FMU_Power_FMU_REV_2A (C19.2 C20.2 R4.P$1 U1001.6), IO_FMU_REV_2A (U7001.1)
VBUS: 80PIN_FMU_REV_2A (U$1.29), FMU_FMU_REV_2A (U1001.68), SD_USB_FMU_REV_2A (J1.VBUS U11.5)
VDD_3V3_SENSORS: FMU_Power_FMU_REV_2A (C16.P$1 C17.P$1 Q1.E U3.8), SENSORS_FMU_REV_2A (13 pins)
VDD_3V3_SENSORS_EN: FMU_FMU_REV_2A (U1001.2), FMU_Power_FMU_REV_2A (R3.P$2 R5.P$2 U3.5)
VDD_3V3_SPEKTRUM_EN: 80PIN_FMU_REV_2A (U$1.19), IO_FMU_REV_2A (U7001.2)
VDD_5V_IN: 80PIN_FMU_REV_2A (5v.P$1 U$1.61 U$1.63), FMU_Power_FMU_REV_2A (L1.P$1), IO_PWR_FMU_REV_2A (F1.1), LEDs_FMU_REV_2A (LED1.A), SD_USB_FMU_REV_2A (RN2002.3)
VDD_5V_SENS: FMU_FMU_REV_2A (U1001.29), SD_USB_FMU_REV_2A (RN2002.13 RN2002.14)
VDD_SERVO: 80PIN_FMU_REV_2A (U$1.53), SD_USB_FMU_REV_2A (R30.P$2)
VDD_SERVO_IN: 80PIN_FMU_REV_2A (U$1.9), IO_PWR_FMU_REV_2A (U7.1)
VDD_SERVO_SENS: IO_FMU_REV_2A (U7001.14), SD_USB_FMU_REV_2A (R31.P$1 RN2002.11)

## Assembly variants
Cube_Orange: not fitted 5v FMU-SWCLK FMU-SWDIO FMU-VDD_3V3 IO-SWCLK IO-SWDIO IO-VDD_3V3 M1 M2 M3 R9 RX5 TX5